# Altium project SpaceVNXBaseBoard.PrjPcb (part 2 of 6)

## Sheet ZynqPL_DDR.SchDoc: ZynqPL_DDR
size A3; Author: Carlos Barreiro; Organization: Escuela Técnica Superior de Ingeniería de Sistemas Informáticos de la Universidad Politécnica de Madrid; Address1: Campus Sur de la Universidad Politécnica de Madrid; Address2: Calle de Alan Turing, s/nº; Address3: Madrid 28031; Address4: España; DocumentNumber: 6; Revision: A; SheetNumber: 6; SheetTotal: 16
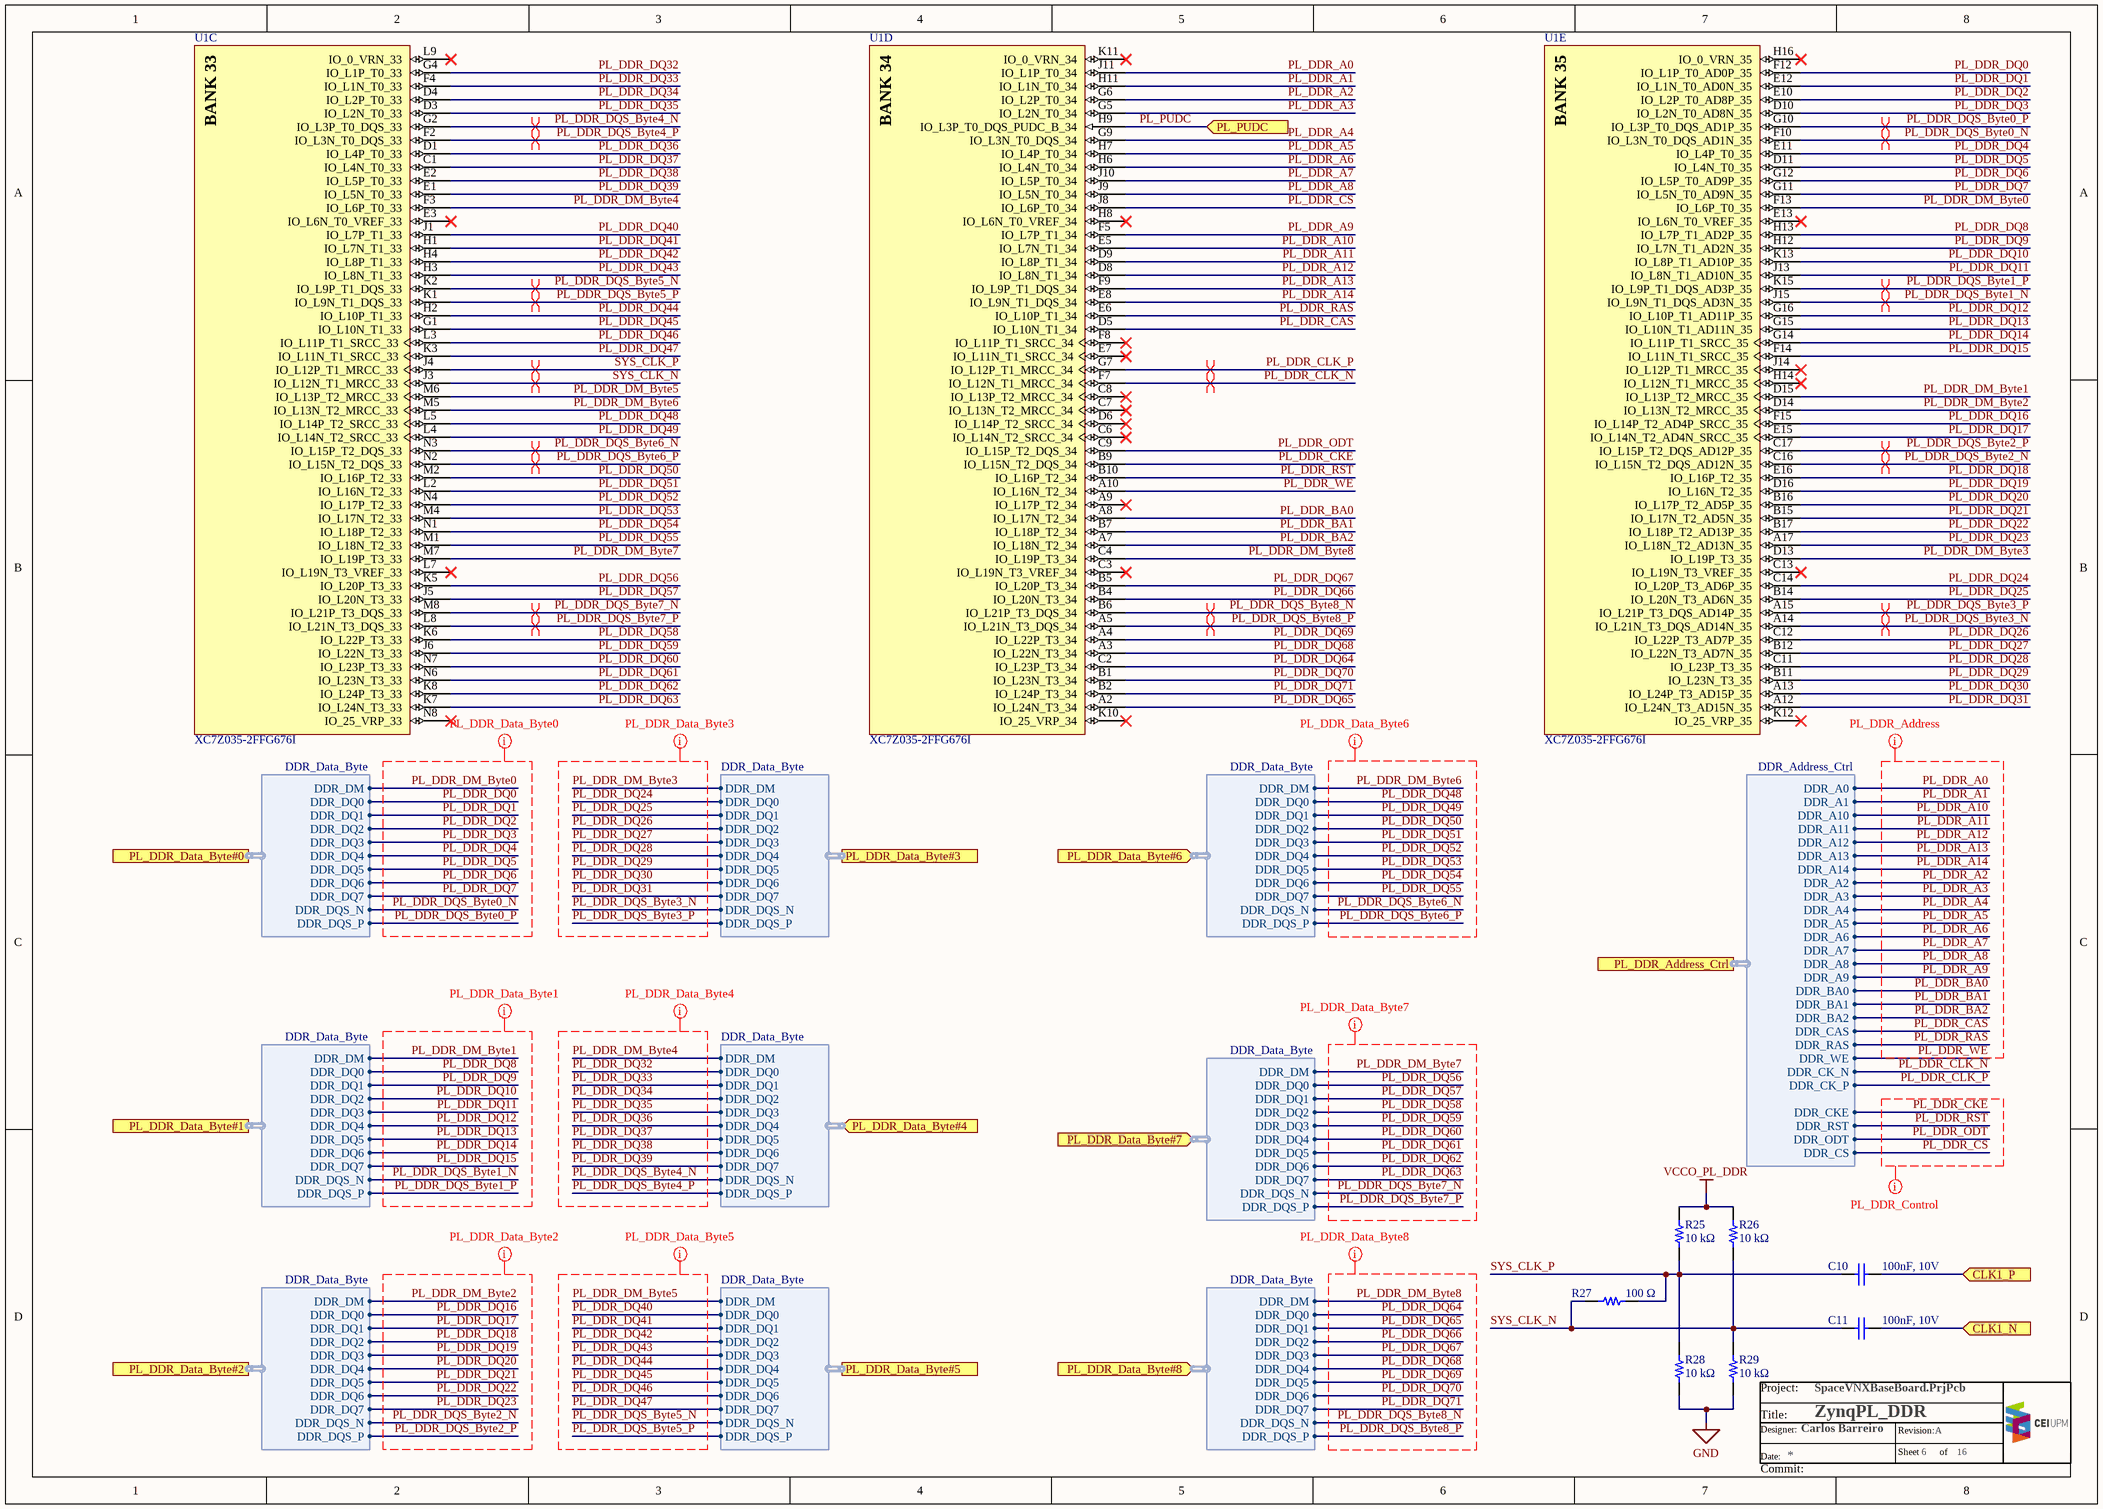
[diagram p3: ZynqPL_DDR.SchDoc]

### Parts
C10  100nF, 10V  [WURTH_WCAP-CSGP_0402]
C11  100nF, 10V  [WURTH_WCAP-CSGP_0402]
R25  10 kΩ  [PANASONIC_ERJ2G_0402]
R26  10 kΩ  [PANASONIC_ERJ2G_0402]
R27  100 Ω  [PANASONIC_ERJ2G_0402]
R28  10 kΩ  [PANASONIC_ERJ2G_0402]
R29  10 kΩ  [PANASONIC_ERJ2G_0402]
U1  XC7Z035-2FFG676I  [XILINX_FBG676]  (parts C,D,E of 13)

### Ports
CLK1_N (in), CLK1_P (in), PL_DDR_Address_Ctrl (harness DDR_Address_Ctrl), PL_DDR_Data_Byte#0 (harness DDR_Data_Byte), PL_DDR_Data_Byte#1 (harness DDR_Data_Byte), PL_DDR_Data_Byte#2 (harness DDR_Data_Byte), PL_DDR_Data_Byte#3 (harness DDR_Data_Byte), PL_DDR_Data_Byte#4 (in, harness DDR_Data_Byte), PL_DDR_Data_Byte#5 (harness DDR_Data_Byte), PL_DDR_Data_Byte#6 (in, harness DDR_Data_Byte), PL_DDR_Data_Byte#7 (in, harness DDR_Data_Byte), PL_DDR_Data_Byte#8 (in, harness DDR_Data_Byte), PL_PUDC (in)

### Harnesses
DDR_Data_Byte: DDR_DM, DDR_DQ0, DDR_DQ1, DDR_DQ2, DDR_DQ3, DDR_DQ4, DDR_DQ5, DDR_DQ6, DDR_DQ7, DDR_DQS_N, DDR_DQS_P
DDR_Address_Ctrl: DDR_A0, DDR_A1, DDR_A10, DDR_A11, DDR_A12, DDR_A13, DDR_A14, DDR_A2, DDR_A3, DDR_A4, DDR_A5, DDR_A6, DDR_A7, DDR_A8, DDR_A9, DDR_BA0, DDR_BA1, DDR_BA2, DDR_CAS, DDR_CK_N, DDR_CK_P, DDR_CKE, DDR_CS, DDR_ODT, DDR_RAS, DDR_RST, DDR_WE

### Nets
GND: R28.1 R29.1
VCCO_PL_DDR: R25.2 R26.2
OUT1_N: C11.2 ; port CLK1_N
OUT1_P: C10.2 ; port CLK1_P
PL_DDR_A0: U1.J11(IO_L1P_T0_34) ; port PL_DDR_Address_Ctrl.DDR_A0
PL_DDR_A1: U1.H11(IO_L1N_T0_34) ; port PL_DDR_Address_Ctrl.DDR_A1
PL_DDR_A2: U1.G6(IO_L2P_T0_34) ; port PL_DDR_Address_Ctrl.DDR_A2
PL_DDR_A3: U1.G5(IO_L2N_T0_34) ; port PL_DDR_Address_Ctrl.DDR_A3
PL_DDR_A4: U1.G9(IO_L3N_T0_DQS_34) ; port PL_DDR_Address_Ctrl.DDR_A4
PL_DDR_A5: U1.H7(IO_L4P_T0_34) ; port PL_DDR_Address_Ctrl.DDR_A5
PL_DDR_A6: U1.H6(IO_L4N_T0_34) ; port PL_DDR_Address_Ctrl.DDR_A6
PL_DDR_A7: U1.J10(IO_L5P_T0_34) ; port PL_DDR_Address_Ctrl.DDR_A7
PL_DDR_A8: U1.J9(IO_L5N_T0_34) ; port PL_DDR_Address_Ctrl.DDR_A8
PL_DDR_A9: U1.F5(IO_L7P_T1_34) ; port PL_DDR_Address_Ctrl.DDR_A9
PL_DDR_A10: U1.E5(IO_L7N_T1_34) ; port PL_DDR_Address_Ctrl.DDR_A10
PL_DDR_A11: U1.D9(IO_L8P_T1_34) ; port PL_DDR_Address_Ctrl.DDR_A11
PL_DDR_A12: U1.D8(IO_L8N_T1_34) ; port PL_DDR_Address_Ctrl.DDR_A12
PL_DDR_A13: U1.F9(IO_L9P_T1_DQS_34) ; port PL_DDR_Address_Ctrl.DDR_A13
PL_DDR_A14: U1.E8(IO_L9N_T1_DQS_34) ; port PL_DDR_Address_Ctrl.DDR_A14
PL_DDR_BA0: U1.A8(IO_L17N_T2_34) ; port PL_DDR_Address_Ctrl.DDR_BA0
PL_DDR_BA1: U1.B7(IO_L18P_T2_34) ; port PL_DDR_Address_Ctrl.DDR_BA1
PL_DDR_BA2: U1.A7(IO_L18N_T2_34) ; port PL_DDR_Address_Ctrl.DDR_BA2
PL_DDR_CAS: U1.D5(IO_L10N_T1_34) ; port PL_DDR_Address_Ctrl.DDR_CAS
PL_DDR_CKE: U1.B9(IO_L15N_T2_DQS_34) ; port PL_DDR_Address_Ctrl.DDR_CKE
PL_DDR_CLK_N: U1.F7(IO_L12N_T1_MRCC_34) ; port PL_DDR_Address_Ctrl.DDR_CK_N
PL_DDR_CLK_P: U1.G7(IO_L12P_T1_MRCC_34) ; port PL_DDR_Address_Ctrl.DDR_CK_P
PL_DDR_CS: U1.J8(IO_L6P_T0_34) ; port PL_DDR_Address_Ctrl.DDR_CS
PL_DDR_DM_Byte0: U1.F13(IO_L6P_T0_35) ; port PL_DDR_Data_Byte#0.DDR_DM
PL_DDR_DM_Byte1: U1.D15(IO_L13P_T2_MRCC_35) ; port PL_DDR_Data_Byte#1.DDR_DM
PL_DDR_DM_Byte2: U1.D14(IO_L13N_T2_MRCC_35) ; port PL_DDR_Data_Byte#2.DDR_DM
PL_DDR_DM_Byte3: U1.D13(IO_L19P_T3_35) ; port PL_DDR_Data_Byte#3.DDR_DM
PL_DDR_DM_Byte4: U1.F3(IO_L6P_T0_33) ; port PL_DDR_Data_Byte#4.DDR_DM
PL_DDR_DM_Byte5: U1.M6(IO_L13P_T2_MRCC_33) ; port PL_DDR_Data_Byte#5.DDR_DM
PL_DDR_DM_Byte6: U1.M5(IO_L13N_T2_MRCC_33) ; port PL_DDR_Data_Byte#6.DDR_DM
PL_DDR_DM_Byte7: U1.M7(IO_L19P_T3_33) ; port PL_DDR_Data_Byte#7.DDR_DM
PL_DDR_DM_Byte8: U1.C4(IO_L19P_T3_34) ; port PL_DDR_Data_Byte#8.DDR_DM
PL_DDR_DQ0: U1.F12(IO_L1P_T0_AD0P_35) ; port PL_DDR_Data_Byte#0.DDR_DQ0
PL_DDR_DQ1: U1.E12(IO_L1N_T0_AD0N_35) ; port PL_DDR_Data_Byte#0.DDR_DQ1
PL_DDR_DQ2: U1.E10(IO_L2P_T0_AD8P_35) ; port PL_DDR_Data_Byte#0.DDR_DQ2
PL_DDR_DQ3: U1.D10(IO_L2N_T0_AD8N_35) ; port PL_DDR_Data_Byte#0.DDR_DQ3
PL_DDR_DQ4: U1.E11(IO_L4P_T0_35) ; port PL_DDR_Data_Byte#0.DDR_DQ4
PL_DDR_DQ5: U1.D11(IO_L4N_T0_35) ; port PL_DDR_Data_Byte#0.DDR_DQ5
PL_DDR_DQ6: U1.G12(IO_L5P_T0_AD9P_35) ; port PL_DDR_Data_Byte#0.DDR_DQ6
PL_DDR_DQ7: U1.G11(IO_L5N_T0_AD9N_35) ; port PL_DDR_Data_Byte#0.DDR_DQ7
PL_DDR_DQ8: U1.H13(IO_L7P_T1_AD2P_35) ; port PL_DDR_Data_Byte#1.DDR_DQ0
PL_DDR_DQ9: U1.H12(IO_L7N_T1_AD2N_35) ; port PL_DDR_Data_Byte#1.DDR_DQ1
PL_DDR_DQ10: U1.K13(IO_L8P_T1_AD10P_35) ; port PL_DDR_Data_Byte#1.DDR_DQ2
PL_DDR_DQ11: U1.J13(IO_L8N_T1_AD10N_35) ; port PL_DDR_Data_Byte#1.DDR_DQ3
PL_DDR_DQ12: U1.G16(IO_L10P_T1_AD11P_35) ; port PL_DDR_Data_Byte#1.DDR_DQ4
PL_DDR_DQ13: U1.G15(IO_L10N_T1_AD11N_35) ; port PL_DDR_Data_Byte#1.DDR_DQ5
PL_DDR_DQ14: U1.G14(IO_L11P_T1_SRCC_35) ; port PL_DDR_Data_Byte#1.DDR_DQ6
PL_DDR_DQ15: U1.F14(IO_L11N_T1_SRCC_35) ; port PL_DDR_Data_Byte#1.DDR_DQ7
PL_DDR_DQ16: U1.F15(IO_L14P_T2_AD4P_SRCC_35) ; port PL_DDR_Data_Byte#2.DDR_DQ0
PL_DDR_DQ17: U1.E15(IO_L14N_T2_AD4N_SRCC_35) ; port PL_DDR_Data_Byte#2.DDR_DQ1
PL_DDR_DQ18: U1.E16(IO_L16P_T2_35) ; port PL_DDR_Data_Byte#2.DDR_DQ2
PL_DDR_DQ19: U1.D16(IO_L16N_T2_35) ; port PL_DDR_Data_Byte#2.DDR_DQ3
PL_DDR_DQ20: U1.B16(IO_L17P_T2_AD5P_35) ; port PL_DDR_Data_Byte#2.DDR_DQ4
PL_DDR_DQ21: U1.B15(IO_L17N_T2_AD5N_35) ; port PL_DDR_Data_Byte#2.DDR_DQ5
PL_DDR_DQ22: U1.B17(IO_L18P_T2_AD13P_35) ; port PL_DDR_Data_Byte#2.DDR_DQ6
PL_DDR_DQ23: U1.A17(IO_L18N_T2_AD13N_35) ; port PL_DDR_Data_Byte#2.DDR_DQ7
PL_DDR_DQ24: U1.C14(IO_L20P_T3_AD6P_35) ; port PL_DDR_Data_Byte#3.DDR_DQ0
PL_DDR_DQ25: U1.B14(IO_L20N_T3_AD6N_35) ; port PL_DDR_Data_Byte#3.DDR_DQ1
PL_DDR_DQ26: U1.C12(IO_L22P_T3_AD7P_35) ; port PL_DDR_Data_Byte#3.DDR_DQ2
PL_DDR_DQ27: U1.B12(IO_L22N_T3_AD7N_35) ; port PL_DDR_Data_Byte#3.DDR_DQ3
PL_DDR_DQ28: U1.C11(IO_L23P_T3_35) ; port PL_DDR_Data_Byte#3.DDR_DQ4
PL_DDR_DQ29: U1.B11(IO_L23N_T3_35) ; port PL_DDR_Data_Byte#3.DDR_DQ5
PL_DDR_DQ30: U1.A13(IO_L24P_T3_AD15P_35) ; port PL_DDR_Data_Byte#3.DDR_DQ6
PL_DDR_DQ31: U1.A12(IO_L24N_T3_AD15N_35) ; port PL_DDR_Data_Byte#3.DDR_DQ7
PL_DDR_DQ32: U1.G4(IO_L1P_T0_33) ; port PL_DDR_Data_Byte#4.DDR_DQ0
PL_DDR_DQ33: U1.F4(IO_L1N_T0_33) ; port PL_DDR_Data_Byte#4.DDR_DQ1
PL_DDR_DQ34: U1.D4(IO_L2P_T0_33) ; port PL_DDR_Data_Byte#4.DDR_DQ2
PL_DDR_DQ35: U1.D3(IO_L2N_T0_33) ; port PL_DDR_Data_Byte#4.DDR_DQ3
PL_DDR_DQ36: U1.D1(IO_L4P_T0_33) ; port PL_DDR_Data_Byte#4.DDR_DQ4
PL_DDR_DQ37: U1.C1(IO_L4N_T0_33) ; port PL_DDR_Data_Byte#4.DDR_DQ5
PL_DDR_DQ38: U1.E2(IO_L5P_T0_33) ; port PL_DDR_Data_Byte#4.DDR_DQ6
PL_DDR_DQ39: U1.E1(IO_L5N_T0_33) ; port PL_DDR_Data_Byte#4.DDR_DQ7
PL_DDR_DQ40: U1.J1(IO_L7P_T1_33) ; port PL_DDR_Data_Byte#5.DDR_DQ0
PL_DDR_DQ41: U1.H1(IO_L7N_T1_33) ; port PL_DDR_Data_Byte#5.DDR_DQ1
PL_DDR_DQ42: U1.H4(IO_L8P_T1_33) ; port PL_DDR_Data_Byte#5.DDR_DQ2
PL_DDR_DQ43: U1.H3(IO_L8N_T1_33) ; port PL_DDR_Data_Byte#5.DDR_DQ3
PL_DDR_DQ44: U1.H2(IO_L10P_T1_33) ; port PL_DDR_Data_Byte#5.DDR_DQ4
PL_DDR_DQ45: U1.G1(IO_L10N_T1_33) ; port PL_DDR_Data_Byte#5.DDR_DQ5
PL_DDR_DQ46: U1.L3(IO_L11P_T1_SRCC_33) ; port PL_DDR_Data_Byte#5.DDR_DQ6
PL_DDR_DQ47: U1.K3(IO_L11N_T1_SRCC_33) ; port PL_DDR_Data_Byte#5.DDR_DQ7
PL_DDR_DQ48: U1.L5(IO_L14P_T2_SRCC_33) ; port PL_DDR_Data_Byte#6.DDR_DQ0
PL_DDR_DQ49: U1.L4(IO_L14N_T2_SRCC_33) ; port PL_DDR_Data_Byte#6.DDR_DQ1
PL_DDR_DQ50: U1.M2(IO_L16P_T2_33) ; port PL_DDR_Data_Byte#6.DDR_DQ2
PL_DDR_DQ51: U1.L2(IO_L16N_T2_33) ; port PL_DDR_Data_Byte#6.DDR_DQ3
PL_DDR_DQ52: U1.N4(IO_L17P_T2_33) ; port PL_DDR_Data_Byte#6.DDR_DQ4
PL_DDR_DQ53: U1.M4(IO_L17N_T2_33) ; port PL_DDR_Data_Byte#6.DDR_DQ5
PL_DDR_DQ54: U1.N1(IO_L18P_T2_33) ; port PL_DDR_Data_Byte#6.DDR_DQ6
PL_DDR_DQ55: U1.M1(IO_L18N_T2_33) ; port PL_DDR_Data_Byte#6.DDR_DQ7
PL_DDR_DQ56: U1.K5(IO_L20P_T3_33) ; port PL_DDR_Data_Byte#7.DDR_DQ0
PL_DDR_DQ57: U1.J5(IO_L20N_T3_33) ; port PL_DDR_Data_Byte#7.DDR_DQ1
PL_DDR_DQ58: U1.K6(IO_L22P_T3_33) ; port PL_DDR_Data_Byte#7.DDR_DQ2
PL_DDR_DQ59: U1.J6(IO_L22N_T3_33) ; port PL_DDR_Data_Byte#7.DDR_DQ3
PL_DDR_DQ60: U1.N7(IO_L23P_T3_33) ; port PL_DDR_Data_Byte#7.DDR_DQ4
PL_DDR_DQ61: U1.N6(IO_L23N_T3_33) ; port PL_DDR_Data_Byte#7.DDR_DQ5
PL_DDR_DQ62: U1.K8(IO_L24P_T3_33) ; port PL_DDR_Data_Byte#7.DDR_DQ6
PL_DDR_DQ63: U1.K7(IO_L24N_T3_33) ; port PL_DDR_Data_Byte#7.DDR_DQ7
PL_DDR_DQ64: U1.C2(IO_L23P_T3_34) ; port PL_DDR_Data_Byte#8.DDR_DQ0
PL_DDR_DQ65: U1.A2(IO_L24N_T3_34) ; port PL_DDR_Data_Byte#8.DDR_DQ1
PL_DDR_DQ66: U1.B4(IO_L20N_T3_34) ; port PL_DDR_Data_Byte#8.DDR_DQ2
PL_DDR_DQ67: U1.B5(IO_L20P_T3_34) ; port PL_DDR_Data_Byte#8.DDR_DQ3
PL_DDR_DQ68: U1.A3(IO_L22N_T3_34) ; port PL_DDR_Data_Byte#8.DDR_DQ4
PL_DDR_DQ69: U1.A4(IO_L22P_T3_34) ; port PL_DDR_Data_Byte#8.DDR_DQ5
PL_DDR_DQ70: U1.B1(IO_L23N_T3_34) ; port PL_DDR_Data_Byte#8.DDR_DQ6
PL_DDR_DQ71: U1.B2(IO_L24P_T3_34) ; port PL_DDR_Data_Byte#8.DDR_DQ7
PL_DDR_DQS_Byte0_N: U1.F10(IO_L3N_T0_DQS_AD1N_35) ; port PL_DDR_Data_Byte#0.DDR_DQS_N
PL_DDR_DQS_Byte0_P: U1.G10(IO_L3P_T0_DQS_AD1P_35) ; port PL_DDR_Data_Byte#0.DDR_DQS_P
PL_DDR_DQS_Byte1_N: U1.J15(IO_L9N_T1_DQS_AD3N_35) ; port PL_DDR_Data_Byte#1.DDR_DQS_N
PL_DDR_DQS_Byte1_P: U1.K15(IO_L9P_T1_DQS_AD3P_35) ; port PL_DDR_Data_Byte#1.DDR_DQS_P
PL_DDR_DQS_Byte2_N: U1.C16(IO_L15N_T2_DQS_AD12N_35) ; port PL_DDR_Data_Byte#2.DDR_DQS_N
PL_DDR_DQS_Byte2_P: U1.C17(IO_L15P_T2_DQS_AD12P_35) ; port PL_DDR_Data_Byte#2.DDR_DQS_P
PL_DDR_DQS_Byte3_N: U1.A14(IO_L21N_T3_DQS_AD14N_35) ; port PL_DDR_Data_Byte#3.DDR_DQS_N
PL_DDR_DQS_Byte3_P: U1.A15(IO_L21P_T3_DQS_AD14P_35) ; port PL_DDR_Data_Byte#3.DDR_DQS_P
PL_DDR_DQS_Byte4_N: U1.G2(IO_L3P_T0_DQS_33) ; port PL_DDR_Data_Byte#4.DDR_DQS_N
PL_DDR_DQS_Byte4_P: U1.F2(IO_L3N_T0_DQS_33) ; port PL_DDR_Data_Byte#4.DDR_DQS_P
PL_DDR_DQS_Byte5_N: U1.K2(IO_L9P_T1_DQS_33) ; port PL_DDR_Data_Byte#5.DDR_DQS_N
PL_DDR_DQS_Byte5_P: U1.K1(IO_L9N_T1_DQS_33) ; port PL_DDR_Data_Byte#5.DDR_DQS_P
PL_DDR_DQS_Byte6_N: U1.N3(IO_L15P_T2_DQS_33) ; port PL_DDR_Data_Byte#6.DDR_DQS_N
PL_DDR_DQS_Byte6_P: U1.N2(IO_L15N_T2_DQS_33) ; port PL_DDR_Data_Byte#6.DDR_DQS_P
PL_DDR_DQS_Byte7_N: U1.M8(IO_L21P_T3_DQS_33) ; port PL_DDR_Data_Byte#7.DDR_DQS_N
PL_DDR_DQS_Byte7_P: U1.L8(IO_L21N_T3_DQS_33) ; port PL_DDR_Data_Byte#7.DDR_DQS_P
PL_DDR_DQS_Byte8_N: U1.B6(IO_L21P_T3_DQS_34) ; port PL_DDR_Data_Byte#8.DDR_DQS_N
PL_DDR_DQS_Byte8_P: U1.A5(IO_L21N_T3_DQS_34) ; port PL_DDR_Data_Byte#8.DDR_DQS_P
PL_DDR_ODT: U1.C9(IO_L15P_T2_DQS_34) ; port PL_DDR_Address_Ctrl.DDR_ODT
PL_DDR_RAS: U1.E6(IO_L10P_T1_34) ; port PL_DDR_Address_Ctrl.DDR_RAS
PL_DDR_RST: U1.B10(IO_L16P_T2_34) ; port PL_DDR_Address_Ctrl.DDR_RST
PL_DDR_WE: U1.A10(IO_L16N_T2_34) ; port PL_DDR_Address_Ctrl.DDR_WE
PL_PUDC: U1.H9(IO_L3P_T0_DQS_PUDC_B_34) ; port PL_PUDC
SYS_CLK_N: C11.1 R26.1 R27.1 R29.2 U1.J3(IO_L12N_T1_MRCC_33)
SYS_CLK_P: C10.1 R25.1 R27.2 R28.2 U1.J4(IO_L12P_T1_MRCC_33)

Not connected (* = marked no-connect by the designer): U1 A9(IO_L17P_T2_34)* C3(IO_L19N_T3_VREF_34)* C6(IO_L14N_T2_SRCC_34)* C7(IO_L13N_T2_MRCC_34)* C8(IO_L13P_T2_MRCC_34)* C13(IO_L19N_T3_VREF_35)* D6(IO_L14P_T2_SRCC_34)* E3(IO_L6N_T0_VREF_33)* E7(IO_L11N_T1_SRCC_34)* E13(IO_L6N_T0_VREF_35)* F8(IO_L11P_T1_SRCC_34)* H8(IO_L6N_T0_VREF_34)* H14(IO_L12N_T1_MRCC_35)* H16(IO_0_VRN_35)* J14(IO_L12P_T1_MRCC_35)* K10(IO_25_VRP_34)* K11(IO_0_VRN_34)* K12(IO_25_VRP_35)* L7(IO_L19N_T3_VREF_33)* L9(IO_0_VRN_33)* N8(IO_25_VRP_33)*

### Layout directives
differential pair: PL_DDR_CLK_N, PL_DDR_CLK_P, PL_DDR_DQS_Byte0_N, PL_DDR_DQS_Byte0_P, PL_DDR_DQS_Byte1_N, PL_DDR_DQS_Byte1_P, PL_DDR_DQS_Byte2_N, PL_DDR_DQS_Byte2_P, PL_DDR_DQS_Byte3_N, PL_DDR_DQS_Byte3_P, PL_DDR_DQS_Byte4_N, PL_DDR_DQS_Byte4_P, PL_DDR_DQS_Byte5_N, PL_DDR_DQS_Byte5_P, PL_DDR_DQS_Byte6_N, PL_DDR_DQS_Byte6_P, PL_DDR_DQS_Byte7_N, PL_DDR_DQS_Byte7_P, PL_DDR_DQS_Byte8_N, PL_DDR_DQS_Byte8_P, SYS_CLK_N, SYS_CLK_P
net class PL_DDR_Address: PL_DDR_A0, PL_DDR_A1, PL_DDR_A2, PL_DDR_A3, PL_DDR_A4, PL_DDR_A5, PL_DDR_A6, PL_DDR_A7, PL_DDR_A8, PL_DDR_A9, PL_DDR_A10, PL_DDR_A11, PL_DDR_A12, PL_DDR_A13, PL_DDR_A14, PL_DDR_BA0, PL_DDR_BA1, PL_DDR_BA2, PL_DDR_CAS, PL_DDR_RAS, PL_DDR_WE
net class PL_DDR_Data_Byte6: PL_DDR_DM_Byte6, PL_DDR_DQ48, PL_DDR_DQ49, PL_DDR_DQ50, PL_DDR_DQ51, PL_DDR_DQ52, PL_DDR_DQ53, PL_DDR_DQ54, PL_DDR_DQ55, PL_DDR_DQS_Byte6_N, PL_DDR_DQS_Byte6_P
net class PL_DDR_Data_Byte7: PL_DDR_DM_Byte7, PL_DDR_DQ56, PL_DDR_DQ57, PL_DDR_DQ58, PL_DDR_DQ59, PL_DDR_DQ60, PL_DDR_DQ61, PL_DDR_DQ62, PL_DDR_DQ63, PL_DDR_DQS_Byte7_N, PL_DDR_DQS_Byte7_P
net class PL_DDR_Data_Byte8: PL_DDR_DM_Byte8, PL_DDR_DQ64, PL_DDR_DQ65, PL_DDR_DQ66, PL_DDR_DQ67, PL_DDR_DQ68, PL_DDR_DQ69, PL_DDR_DQ70, PL_DDR_DQ71, PL_DDR_DQS_Byte8_N, PL_DDR_DQS_Byte8_P
net class PL_DDR_Data_Byte3: PL_DDR_DM_Byte3, PL_DDR_DQ24, PL_DDR_DQ25, PL_DDR_DQ26, PL_DDR_DQ27, PL_DDR_DQ28, PL_DDR_DQ29, PL_DDR_DQ30, PL_DDR_DQ31, PL_DDR_DQS_Byte3_N, PL_DDR_DQS_Byte3_P
net class PL_DDR_Data_Byte4: PL_DDR_DM_Byte4, PL_DDR_DQ32, PL_DDR_DQ33, PL_DDR_DQ34, PL_DDR_DQ35, PL_DDR_DQ36, PL_DDR_DQ37, PL_DDR_DQ38, PL_DDR_DQ39, PL_DDR_DQS_Byte4_N, PL_DDR_DQS_Byte4_P
net class PL_DDR_Data_Byte5: PL_DDR_DM_Byte5, PL_DDR_DQ40, PL_DDR_DQ41, PL_DDR_DQ42, PL_DDR_DQ43, PL_DDR_DQ44, PL_DDR_DQ45, PL_DDR_DQ46, PL_DDR_DQ47, PL_DDR_DQS_Byte5_N, PL_DDR_DQS_Byte5_P
net class PL_DDR_Data_Byte2: PL_DDR_DM_Byte2, PL_DDR_DQ16, PL_DDR_DQ17, PL_DDR_DQ18, PL_DDR_DQ19, PL_DDR_DQ20, PL_DDR_DQ21, PL_DDR_DQ22, PL_DDR_DQ23, PL_DDR_DQS_Byte2_N, PL_DDR_DQS_Byte2_P
net class PL_DDR_Data_Byte1: PL_DDR_DM_Byte1, PL_DDR_DQ8, PL_DDR_DQ9, PL_DDR_DQ10, PL_DDR_DQ11, PL_DDR_DQ12, PL_DDR_DQ13, PL_DDR_DQ14, PL_DDR_DQ15, PL_DDR_DQS_Byte1_N, PL_DDR_DQS_Byte1_P
net class PL_DDR_Data_Byte0: PL_DDR_DM_Byte0, PL_DDR_DQ0, PL_DDR_DQ1, PL_DDR_DQ2, PL_DDR_DQ3, PL_DDR_DQ4, PL_DDR_DQ5, PL_DDR_DQ6, PL_DDR_DQ7, PL_DDR_DQS_Byte0_N, PL_DDR_DQS_Byte0_P
net class PL_DDR_Control: PL_DDR_CKE, PL_DDR_CS, PL_DDR_ODT, PL_DDR_RST

### Notes on the sheet
- Project:
- Title:
- Date:
- Designer:
- Sheet
- Revision:
- of
- Commit:
- (in symbol XC7Z035-2FFG676I, part C) BANK 33
- (in symbol XC7Z035-2FFG676I, part D) BANK 34
- (in symbol XC7Z035-2FFG676I, part E) BANK 35

### Library data of the parts
C10 C11 = 885012205018: WCAP-CSGP Multilayer Ceramic Chip Capacitor, General Purpose, size 0402, X7R, 100nF, 10V; Manufacturer: Wurth Elektronik; Rated Voltage: 10VDC; Isolation Resistance  min.: 5GOhm; Capacitance Tolerance: +/-10%; Dissipation Factor max.: 5%; Technical Reference: X7R0402104K010DFCT10000; ComponentLink1Description: Manufacturer; ComponentLink1URL: http://www.we-online.de; ComponentLink2Description: Datasheet; ComponentLink2URL: https://www.we-online.com/catalog/datasheet/885012205018.pdf; Operating Temperature: -55 to +125degC; Packaging: Tape and Reel; Manufacturer Part Number: 885012205018; Published Date: April 2021; Ceramic Type: X7R; Height: 0.5mm; Mounting Technology: SMT; Size: 0402; Capacitance: 100nF; Q-Factor min.: -
R25 R26 R28 R29 = ERJ2RKF1002X: General Purpose Thick Film Chip Resistors; Manufacturer: Panasonic; Power (0402): 0.1 W; Limiting Voltage (0402): 50; Maximum Voltage (0402): 100; Resistance Range (Ω): 1Ω to 100MΩ; AEC 200: Grade 0; Size (0402): 2GE; ComponentLink1Description: Catalog; ComponentLink1URL: https://industrial.panasonic.com/ww/products/pt/general-purpose-chip-resistors/models?op=search&model_status_current=1&page=0#model-list-search-results; Series: ERJ; Temperature Range (ºC): -55 to +155; Supplier 1: Digi-Key; Supplier 2: Mouser; Supplier Part Number 1: P10.0KLCT-ND; Supplier Part Number 2: 667-ERJ-2RKF1002X
R27 = ERJ2GEJ101X: General Purpose Thick Film Chip Resistors; Manufacturer: Panasonic; Power (0402): 0.1 W; Limiting Voltage (0402): 50; Maximum Voltage (0402): 100; Resistance Range (Ω): 1Ω to 100MΩ; AEC 200: Grade 0; Size (0402): 2GE; ComponentLink1Description: Catalog; ComponentLink1URL: https://industrial.panasonic.com/ww/products/pt/general-purpose-chip-resistors/models?op=search&model_status_current=1&page=0#model-list-search-results; Series: ERJ; Temperature Range (ºC): -55 to +155; Supplier 1: Digi-Key; Supplier 2: Mouser; Supplier Part Number 2: 667-ERJ-2GEJ101X; Supplier Part Number 1: P100JTR-ND
U1 = XC7Z035-2FFG676I: 667 MHz Zynq™-7000 AP SoC, 130 PS I/O, 254 FPGA I/O, 676-Ball BGA, Speed Grade 1, Commercial Grade, Pb-Free; PartNumber: XC7Z035-2FBG676I; LUTs: 171,900; Extensible Block RAM (# 36Kb Blocks): 17.6Mb (500); Speed Grade: -2; Flip Flops: 343,800; ComponentLink5Description: Packaging and Pinout; ComponentLink4Description: Package File; ComponentLink5URL: http://www.xilinx.com/support/documentation/user_guides/ug865-Zynq-7000-Pkg-Pinout.pdf; Generic Part Number: XC7Z035; ComponentLink1Description: Datasheet; ComponentLink2Description: Package Specification; ComponentLink3URL: http://www.xilinx.com/support/documentation/data_sheets/ds191-XC7Z030-XC7Z045-data-sheet.pdf; ComponentLink1URL: http://www.xilinx.com/support/documentation/data_sheets/ds190-Zynq-7000-Overview.pdf; ComponentLink6Description: PCB and Layout Guide; Package: FBG676; ComponentLink3Description: DC and AC Switching Characteristics; ComponentLink6URL: http://www.xilinx.com/support/documentation/user_guides/ug483_7Series_PCB.pdf; RoHS: Pb-Free; ComponentLink4URL: http://www.xilinx.com/support/packagefiles/z7packages/xc7z030fbg676pkg.txt; ComponentLink2URL: http://www.xilinx.com/support/documentation/user_guides/ug475_7Series_Pkg_Pinout.pdf; PackageDescription: Flip-Chip Lidless BGA, Body 27 x 27 mm, 1.0 mm Pitch; Supplier 1: Digi-Key; Supplier 2: Mouser; Supplier Part Number 1: XC7Z035-2FFG676I-ND; Supplier Part Number 2: 217-XC7Z035-2FFG676I

## Sheet ZynqPL_GTXE2.SchDoc: ZynqPL_GTXE2
size A4; Author: Carlos Barreiro; Organization: Escuela Técnica Superior de Ingeniería de Sistemas Informáticos de la Universidad Politécnica de Madrid; Address1: Campus Sur de la Universidad Politécnica de Madrid; Address2: Calle de Alan Turing, s/nº; Address3: Madrid 28031; Address4: España; DocumentNumber: 7; Revision: A; SheetNumber: 7; SheetTotal: 16
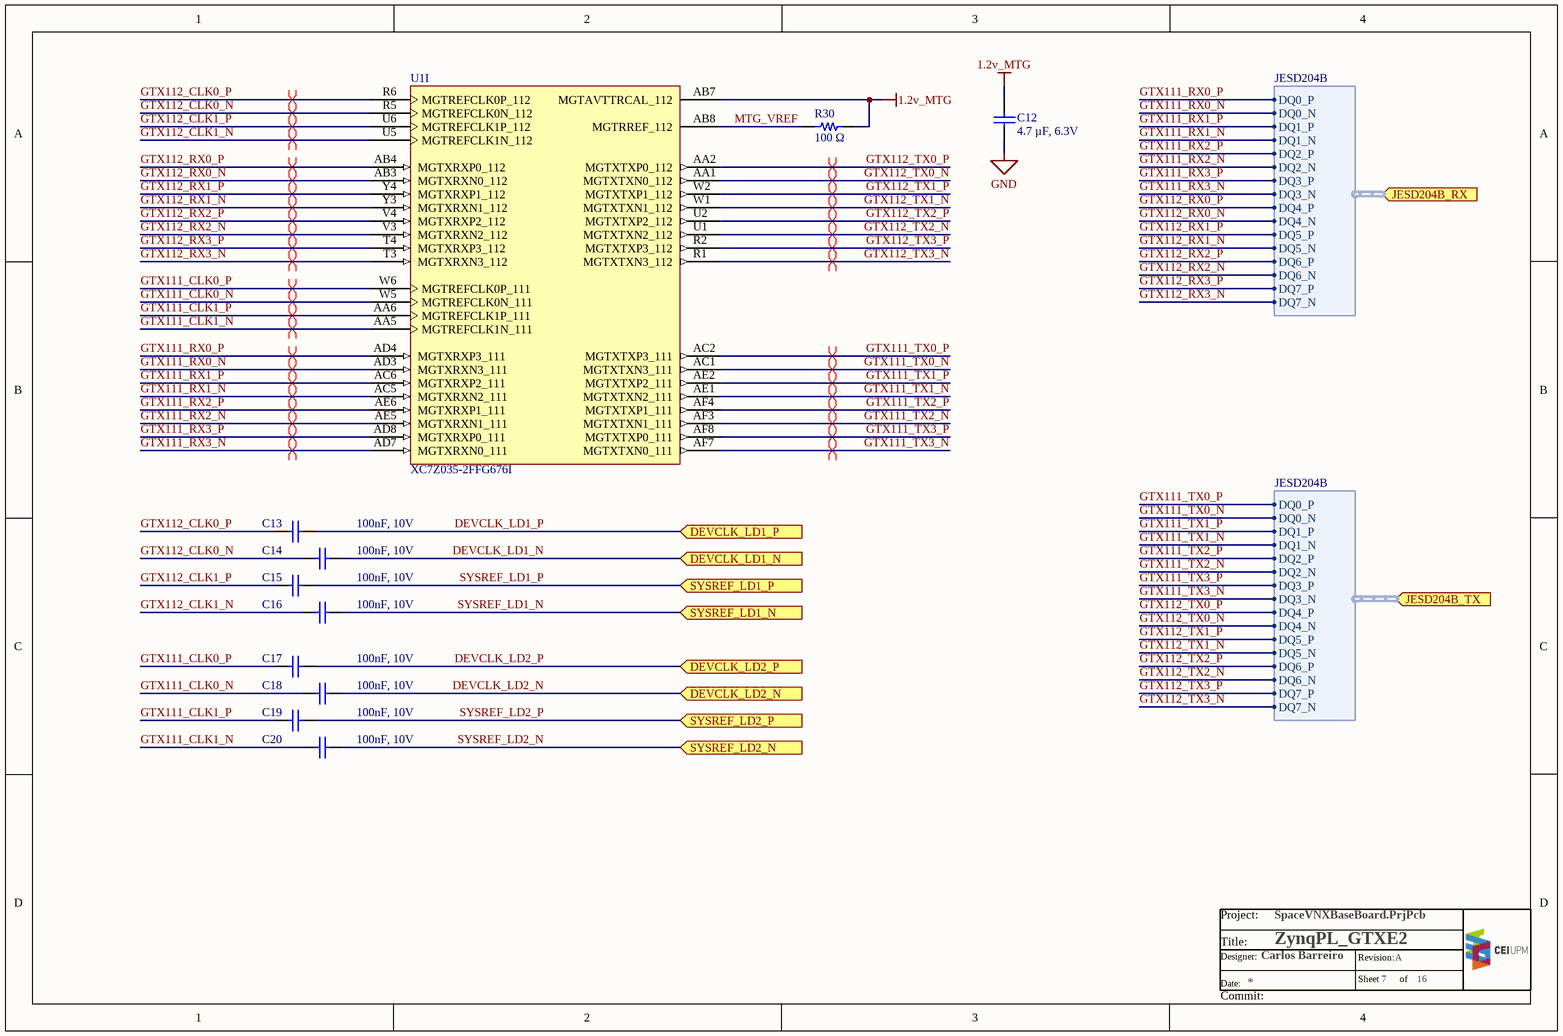
[diagram p4: ZynqPL_GTXE2.SchDoc]

### Parts
C12  4.7 µF, 6.3V  [WURTH_WCAP-CSGP_0402]
C13  100nF, 10V  [WURTH_WCAP-CSGP_0402]
C14  100nF, 10V  [WURTH_WCAP-CSGP_0402]
C15  100nF, 10V  [WURTH_WCAP-CSGP_0402]
C16  100nF, 10V  [WURTH_WCAP-CSGP_0402]
C17  100nF, 10V  [WURTH_WCAP-CSGP_0402]
C18  100nF, 10V  [WURTH_WCAP-CSGP_0402]
C19  100nF, 10V  [WURTH_WCAP-CSGP_0402]
C20  100nF, 10V  [WURTH_WCAP-CSGP_0402]
R30  100 Ω  [PANASONIC_ERJ2G_0402]
U1  XC7Z035-2FFG676I  [XILINX_FBG676]  (part I of 13)

### Ports
DEVCLK_LD1_N (in), DEVCLK_LD1_P (in), DEVCLK_LD2_N (in), DEVCLK_LD2_P (in), JESD204B_RX (in, harness JESD204B), JESD204B_TX (in, harness JESD204B), SYSREF_LD1_N (in), SYSREF_LD1_P (in), SYSREF_LD2_N (in), SYSREF_LD2_P (in)

### Harnesses
JESD204B: DQ0_P, DQ0_N, DQ1_P, DQ1_N, DQ2_P, DQ2_N, DQ3_P, DQ3_N, DQ4_P, DQ4_N, DQ5_P, DQ5_N, DQ6_P, DQ6_N, DQ7_P, DQ7_N

### Nets
1.2v_MTG: C12.2 R30.2 U1.AB7(MGTAVTTRCAL_112)
GND: C12.1
DEVCLK_LD1_N: C14.2 ; port DEVCLK_LD1_N
DEVCLK_LD1_P: C13.2 ; port DEVCLK_LD1_P
DEVCLK_LD2_N: C18.2 ; port DEVCLK_LD2_N
DEVCLK_LD2_P: C17.2 ; port DEVCLK_LD2_P
GTX111_CLK0_N: C18.1 U1.W5(MGTREFCLK0N_111)
GTX111_CLK0_P: C17.1 U1.W6(MGTREFCLK0P_111)
GTX111_CLK1_N: C20.1 U1.AA5(MGTREFCLK1N_111)
GTX111_CLK1_P: C19.1 U1.AA6(MGTREFCLK1P_111)
GTX111_RX0_N: U1.AD3(MGTXRXN3_111) ; port JESD204B_RX.DQ0_N
GTX111_RX0_P: U1.AD4(MGTXRXP3_111) ; port JESD204B_RX.DQ0_P
GTX111_RX1_N: U1.AC5(MGTXRXN2_111) ; port JESD204B_RX.DQ1_N
GTX111_RX1_P: U1.AC6(MGTXRXP2_111) ; port JESD204B_RX.DQ1_P
GTX111_RX2_N: U1.AE5(MGTXRXN1_111) ; port JESD204B_RX.DQ2_N
GTX111_RX2_P: U1.AE6(MGTXRXP1_111) ; port JESD204B_RX.DQ2_P
GTX111_RX3_N: U1.AD7(MGTXRXN0_111) ; port JESD204B_RX.DQ3_N
GTX111_RX3_P: U1.AD8(MGTXRXP0_111) ; port JESD204B_RX.DQ3_P
GTX111_TX0_N: U1.AC1(MGTXTXN3_111) ; port JESD204B_TX.DQ0_N
GTX111_TX0_P: U1.AC2(MGTXTXP3_111) ; port JESD204B_TX.DQ0_P
GTX111_TX1_N: U1.AE1(MGTXTXN2_111) ; port JESD204B_TX.DQ1_N
GTX111_TX1_P: U1.AE2(MGTXTXP2_111) ; port JESD204B_TX.DQ1_P
GTX111_TX2_N: U1.AF3(MGTXTXN1_111) ; port JESD204B_TX.DQ2_N
GTX111_TX2_P: U1.AF4(MGTXTXP1_111) ; port JESD204B_TX.DQ2_P
GTX111_TX3_N: U1.AF7(MGTXTXN0_111) ; port JESD204B_TX.DQ3_N
GTX111_TX3_P: U1.AF8(MGTXTXP0_111) ; port JESD204B_TX.DQ3_P
GTX112_CLK0_N: C14.1 U1.R5(MGTREFCLK0N_112)
GTX112_CLK0_P: C13.1 U1.R6(MGTREFCLK0P_112)
GTX112_CLK1_N: C16.1 U1.U5(MGTREFCLK1N_112)
GTX112_CLK1_P: C15.1 U1.U6(MGTREFCLK1P_112)
GTX112_RX0_N: U1.AB3(MGTXRXN0_112) ; port JESD204B_RX.DQ4_N
GTX112_RX0_P: U1.AB4(MGTXRXP0_112) ; port JESD204B_RX.DQ4_P
GTX112_RX1_N: U1.Y3(MGTXRXN1_112) ; port JESD204B_RX.DQ5_N
GTX112_RX1_P: U1.Y4(MGTXRXP1_112) ; port JESD204B_RX.DQ5_P
GTX112_RX2_N: U1.V3(MGTXRXN2_112) ; port JESD204B_RX.DQ6_N
GTX112_RX2_P: U1.V4(MGTXRXP2_112) ; port JESD204B_RX.DQ6_P
GTX112_RX3_N: U1.T3(MGTXRXN3_112) ; port JESD204B_RX.DQ7_N
GTX112_RX3_P: U1.T4(MGTXRXP3_112) ; port JESD204B_RX.DQ7_P
GTX112_TX0_N: U1.AA1(MGTXTXN0_112) ; port JESD204B_TX.DQ4_N
GTX112_TX0_P: U1.AA2(MGTXTXP0_112) ; port JESD204B_TX.DQ4_P
GTX112_TX1_N: U1.W1(MGTXTXN1_112) ; port JESD204B_TX.DQ5_N
GTX112_TX1_P: U1.W2(MGTXTXP1_112) ; port JESD204B_TX.DQ5_P
GTX112_TX2_N: U1.U1(MGTXTXN2_112) ; port JESD204B_TX.DQ6_N
GTX112_TX2_P: U1.U2(MGTXTXP2_112) ; port JESD204B_TX.DQ6_P
GTX112_TX3_N: U1.R1(MGTXTXN3_112) ; port JESD204B_TX.DQ7_N
GTX112_TX3_P: U1.R2(MGTXTXP3_112) ; port JESD204B_TX.DQ7_P
MTG_VREF: R30.1 U1.AB8(MGTRREF_112)
SYSREF_LD1_N: C16.2 ; port SYSREF_LD1_N
SYSREF_LD1_P: C15.2 ; port SYSREF_LD1_P
SYSREF_LD2_N: C20.2 ; port SYSREF_LD2_N
SYSREF_LD2_P: C19.2 ; port SYSREF_LD2_P

### Layout directives
differential pair: GTX111_CLK0_N, GTX111_CLK0_P, GTX111_CLK1_N, GTX111_CLK1_P, GTX111_RX0_N, GTX111_RX0_P, GTX111_RX1_N, GTX111_RX1_P, GTX111_RX2_N, GTX111_RX2_P, GTX111_RX3_N, GTX111_RX3_P, GTX111_TX0_N, GTX111_TX0_P, GTX111_TX1_N, GTX111_TX1_P, GTX111_TX2_N, GTX111_TX2_P, GTX111_TX3_N, GTX111_TX3_P, GTX112_CLK0_N, GTX112_CLK0_P, GTX112_CLK1_N, GTX112_CLK1_P, GTX112_RX0_N, GTX112_RX0_P, GTX112_RX1_N, GTX112_RX1_P, GTX112_RX2_N, GTX112_RX2_P, GTX112_RX3_N, GTX112_RX3_P, GTX112_TX0_N, GTX112_TX0_P, GTX112_TX1_N, GTX112_TX1_P, GTX112_TX2_N, GTX112_TX2_P, GTX112_TX3_N, GTX112_TX3_P

### Notes on the sheet
- Project:
- Title:
- Date:
- Designer:
- Sheet
- Revision:
- of
- Commit:

### Library data of the parts
C12 = GRM155C80J475MEAAD: Multilayer Ceramic Capacitors MLCC, size 0402, X5R, 4.7 µF, 6.3V; Manufacturer: Murata; Rated Voltage: 6.3VDC; Ceramic Type: X6S; Capacitance Tolerance: +/-20%; Dissipation Factor max.: 10%; Capacitance: 4.7 µF; Operating Temperature: -55 to +105degC; Packaging: Tape and Reel; Manufacturer Part Number: GRM155C80J475MEAAD; Height: 0.5mm; Mounting Technology: SMT; Size: 0402; Supplier 1: Digi-Key; Supplier 2: Mouser; Supplier Part Number 1: 490-14458-1-ND; Supplier Part Number 2: 81-GRM155C80J475MEAD
C13-C20 = 885012205018: as C10 on sheet ZynqPL_DDR; ComponentLink1Description: Manufacturer; ComponentLink1URL: http://www.we-online.de; ComponentLink2Description: Datasheet; ComponentLink2URL: https://www.we-online.com/catalog/datasheet/885012205018.pdf; Operating Temperature: -55 to +125degC; Packaging: Tape and Reel; Manufacturer Part Number: 885012205018; Published Date: April 2021; Ceramic Type: X7R; Height: 0.5mm; Mounting Technology: SMT; Size: 0402; Capacitance: 100nF; Q-Factor min.: -
R30 = ERJ2GEJ101X: as R27 on sheet ZynqPL_DDR; Size (0402): 2GE; ComponentLink1Description: Catalog; ComponentLink1URL: https://industrial.panasonic.com/ww/products/pt/general-purpose-chip-resistors/models?op=search&model_status_current=1&page=0#model-list-search-results; Series: ERJ; Temperature Range (ºC): -55 to +155; Supplier 1: Digi-Key; Supplier 2: Mouser; Supplier Part Number 2: 667-ERJ-2GEJ101X; Supplier Part Number 1: P100JTR-ND
U1 = XC7Z035-2FFG676I: as U1 on sheet ZynqPL_DDR; ComponentLink5Description: Packaging and Pinout; ComponentLink4Description: Package File; ComponentLink5URL: http://www.xilinx.com/support/documentation/user_guides/ug865-Zynq-7000-Pkg-Pinout.pdf; Generic Part Number: XC7Z035; ComponentLink1Description: Datasheet; ComponentLink2Description: Package Specification; ComponentLink3URL: http://www.xilinx.com/support/documentation/data_sheets/ds191-XC7Z030-XC7Z045-data-sheet.pdf; ComponentLink1URL: http://www.xilinx.com/support/documentation/data_sheets/ds190-Zynq-7000-Overview.pdf; ComponentLink6Description: PCB and Layout Guide; Package: FBG676; ComponentLink3Description: DC and AC Switching Characteristics; ComponentLink6URL: http://www.xilinx.com/support/documentation/user_guides/ug483_7Series_PCB.pdf; RoHS: Pb-Free; ComponentLink4URL: http://www.xilinx.com/support/packagefiles/z7packages/xc7z030fbg676pkg.txt; ComponentLink2URL: http://www.xilinx.com/support/documentation/user_guides/ug475_7Series_Pkg_Pinout.pdf; PackageDescription: Flip-Chip Lidless BGA, Body 27 x 27 mm, 1.0 mm Pitch; Supplier 1: Digi-Key; Supplier 2: Mouser; Supplier Part Number 1: XC7Z035-2FFG676I-ND; Supplier Part Number 2: 217-XC7Z035-2FFG676I

## Sheet PL_DDR.SchDoc: PL_DDR
size A4 portrait; Author: Carlos Barreiro; Organization: Escuela Técnica Superior de Ingeniería de Sistemas Informáticos de la Universidad Politécnica de Madrid; Address1: Campus Sur de la Universidad Politécnica de Madrid; Address2: Calle de Alan Turing, s/nº; Address3: Madrid 28031; Address4: España; DocumentNumber: 4; Revision: A; SheetNumber: 4; SheetTotal: 16
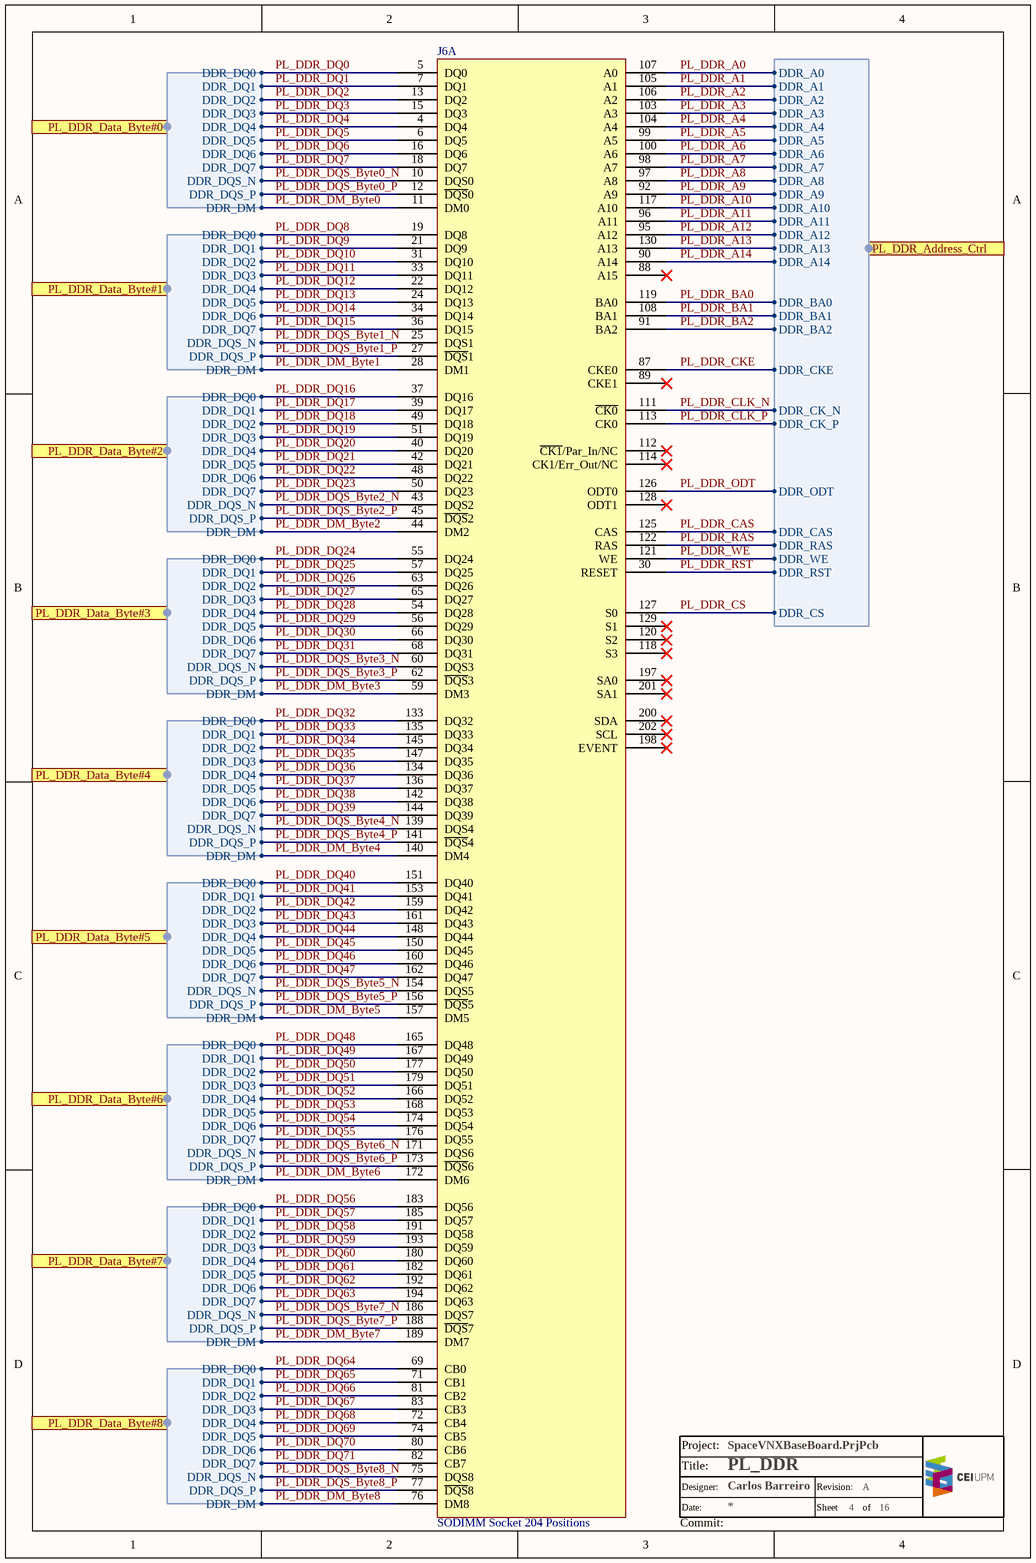
[diagram p5: PL_DDR.SchDoc]

### Parts
J6  SODIMM Socket 204 Positions  [TE_DDR3_SODIMM_RA_Socket]  (part A of 2)

### Ports
PL_DDR_Address_Ctrl (harness DDR_Address_Ctrl), PL_DDR_Data_Byte#0 (harness DDR_Data_Byte), PL_DDR_Data_Byte#1 (harness DDR_Data_Byte), PL_DDR_Data_Byte#2 (harness DDR_Data_Byte), PL_DDR_Data_Byte#3 (harness DDR_Data_Byte), PL_DDR_Data_Byte#4 (in, harness DDR_Data_Byte), PL_DDR_Data_Byte#5 (harness DDR_Data_Byte), PL_DDR_Data_Byte#6 (in, harness DDR_Data_Byte), PL_DDR_Data_Byte#7 (in, harness DDR_Data_Byte), PL_DDR_Data_Byte#8 (in, harness DDR_Data_Byte)

### Harnesses
DDR_Data_Byte: DDR_DM, DDR_DQ0, DDR_DQ1, DDR_DQ2, DDR_DQ3, DDR_DQ4, DDR_DQ5, DDR_DQ6, DDR_DQ7, DDR_DQS_N, DDR_DQS_P
DDR_Address_Ctrl: DDR_A0, DDR_A1, DDR_A10, DDR_A11, DDR_A12, DDR_A13, DDR_A14, DDR_A2, DDR_A3, DDR_A4, DDR_A5, DDR_A6, DDR_A7, DDR_A8, DDR_A9, DDR_BA0, DDR_BA1, DDR_BA2, DDR_CAS, DDR_CK_N, DDR_CK_P, DDR_CKE, DDR_CS, DDR_ODT, DDR_RAS, DDR_RST, DDR_WE

### Nets
PL_DDR_A0: J6.107(A0) ; port PL_DDR_Address_Ctrl.DDR_A0
PL_DDR_A1: J6.105(A1) ; port PL_DDR_Address_Ctrl.DDR_A1
PL_DDR_A2: J6.106(A2) ; port PL_DDR_Address_Ctrl.DDR_A2
PL_DDR_A3: J6.103(A3) ; port PL_DDR_Address_Ctrl.DDR_A3
PL_DDR_A4: J6.104(A4) ; port PL_DDR_Address_Ctrl.DDR_A4
PL_DDR_A5: J6.99(A5) ; port PL_DDR_Address_Ctrl.DDR_A5
PL_DDR_A6: J6.100(A6) ; port PL_DDR_Address_Ctrl.DDR_A6
PL_DDR_A7: J6.98(A7) ; port PL_DDR_Address_Ctrl.DDR_A7
PL_DDR_A8: J6.97(A8) ; port PL_DDR_Address_Ctrl.DDR_A8
PL_DDR_A9: J6.92(A9) ; port PL_DDR_Address_Ctrl.DDR_A9
PL_DDR_A10: J6.117(A10) ; port PL_DDR_Address_Ctrl.DDR_A10
PL_DDR_A11: J6.96(A11) ; port PL_DDR_Address_Ctrl.DDR_A11
PL_DDR_A12: J6.95(A12) ; port PL_DDR_Address_Ctrl.DDR_A12
PL_DDR_A13: J6.130(A13) ; port PL_DDR_Address_Ctrl.DDR_A13
PL_DDR_A14: J6.90(A14) ; port PL_DDR_Address_Ctrl.DDR_A14
PL_DDR_BA0: J6.119(BA0) ; port PL_DDR_Address_Ctrl.DDR_BA0
PL_DDR_BA1: J6.108(BA1) ; port PL_DDR_Address_Ctrl.DDR_BA1
PL_DDR_BA2: J6.91(BA2) ; port PL_DDR_Address_Ctrl.DDR_BA2
PL_DDR_CAS: J6.125(CAS) ; port PL_DDR_Address_Ctrl.DDR_CAS
PL_DDR_CKE: J6.87(CKE0) ; port PL_DDR_Address_Ctrl.DDR_CKE
PL_DDR_CLK_N: J6.111(~{CK0}) ; port PL_DDR_Address_Ctrl.DDR_CK_N
PL_DDR_CLK_P: J6.113(CK0) ; port PL_DDR_Address_Ctrl.DDR_CK_P
PL_DDR_CS: J6.127(S0) ; port PL_DDR_Address_Ctrl.DDR_CS
PL_DDR_DM_Byte0: J6.11(DM0) ; port PL_DDR_Data_Byte#0.DDR_DM
PL_DDR_DM_Byte1: J6.28(DM1) ; port PL_DDR_Data_Byte#1.DDR_DM
PL_DDR_DM_Byte2: J6.44(DM2) ; port PL_DDR_Data_Byte#2.DDR_DM
PL_DDR_DM_Byte3: J6.59(DM3) ; port PL_DDR_Data_Byte#3.DDR_DM
PL_DDR_DM_Byte4: J6.140(DM4) ; port PL_DDR_Data_Byte#4.DDR_DM
PL_DDR_DM_Byte5: J6.157(DM5) ; port PL_DDR_Data_Byte#5.DDR_DM
PL_DDR_DM_Byte6: J6.172(DM6) ; port PL_DDR_Data_Byte#6.DDR_DM
PL_DDR_DM_Byte7: J6.189(DM7) ; port PL_DDR_Data_Byte#7.DDR_DM
PL_DDR_DM_Byte8: J6.76(DM8) ; port PL_DDR_Data_Byte#8.DDR_DM
PL_DDR_DQ0: J6.5(DQ0) ; port PL_DDR_Data_Byte#0.DDR_DQ0
PL_DDR_DQ1: J6.7(DQ1) ; port PL_DDR_Data_Byte#0.DDR_DQ1
PL_DDR_DQ2: J6.13(DQ2) ; port PL_DDR_Data_Byte#0.DDR_DQ2
PL_DDR_DQ3: J6.15(DQ3) ; port PL_DDR_Data_Byte#0.DDR_DQ3
PL_DDR_DQ4: J6.4(DQ4) ; port PL_DDR_Data_Byte#0.DDR_DQ4
PL_DDR_DQ5: J6.6(DQ5) ; port PL_DDR_Data_Byte#0.DDR_DQ5
PL_DDR_DQ6: J6.16(DQ6) ; port PL_DDR_Data_Byte#0.DDR_DQ6
PL_DDR_DQ7: J6.18(DQ7) ; port PL_DDR_Data_Byte#0.DDR_DQ7
PL_DDR_DQ8: J6.19(DQ8) ; port PL_DDR_Data_Byte#1.DDR_DQ0
PL_DDR_DQ9: J6.21(DQ9) ; port PL_DDR_Data_Byte#1.DDR_DQ1
PL_DDR_DQ10: J6.31(DQ10) ; port PL_DDR_Data_Byte#1.DDR_DQ2
PL_DDR_DQ11: J6.33(DQ11) ; port PL_DDR_Data_Byte#1.DDR_DQ3
PL_DDR_DQ12: J6.22(DQ12) ; port PL_DDR_Data_Byte#1.DDR_DQ4
PL_DDR_DQ13: J6.24(DQ13) ; port PL_DDR_Data_Byte#1.DDR_DQ5
PL_DDR_DQ14: J6.34(DQ14) ; port PL_DDR_Data_Byte#1.DDR_DQ6
PL_DDR_DQ15: J6.36(DQ15) ; port PL_DDR_Data_Byte#1.DDR_DQ7
PL_DDR_DQ16: J6.37(DQ16) ; port PL_DDR_Data_Byte#2.DDR_DQ0
PL_DDR_DQ17: J6.39(DQ17) ; port PL_DDR_Data_Byte#2.DDR_DQ1
PL_DDR_DQ18: J6.49(DQ18) ; port PL_DDR_Data_Byte#2.DDR_DQ2
PL_DDR_DQ19: J6.51(DQ19) ; port PL_DDR_Data_Byte#2.DDR_DQ3
PL_DDR_DQ20: J6.40(DQ20) ; port PL_DDR_Data_Byte#2.DDR_DQ4
PL_DDR_DQ21: J6.42(DQ21) ; port PL_DDR_Data_Byte#2.DDR_DQ5
PL_DDR_DQ22: J6.48(DQ22) ; port PL_DDR_Data_Byte#2.DDR_DQ6
PL_DDR_DQ23: J6.50(DQ23) ; port PL_DDR_Data_Byte#2.DDR_DQ7
PL_DDR_DQ24: J6.55(DQ24) ; port PL_DDR_Data_Byte#3.DDR_DQ0
PL_DDR_DQ25: J6.57(DQ25) ; port PL_DDR_Data_Byte#3.DDR_DQ1
PL_DDR_DQ26: J6.63(DQ26) ; port PL_DDR_Data_Byte#3.DDR_DQ2
PL_DDR_DQ27: J6.65(DQ27) ; port PL_DDR_Data_Byte#3.DDR_DQ3
PL_DDR_DQ28: J6.54(DQ28) ; port PL_DDR_Data_Byte#3.DDR_DQ4
PL_DDR_DQ29: J6.56(DQ29) ; port PL_DDR_Data_Byte#3.DDR_DQ5
PL_DDR_DQ30: J6.66(DQ30) ; port PL_DDR_Data_Byte#3.DDR_DQ6
PL_DDR_DQ31: J6.68(DQ31) ; port PL_DDR_Data_Byte#3.DDR_DQ7
PL_DDR_DQ32: J6.133(DQ32) ; port PL_DDR_Data_Byte#4.DDR_DQ0
PL_DDR_DQ33: J6.135(DQ33) ; port PL_DDR_Data_Byte#4.DDR_DQ1
PL_DDR_DQ34: J6.145(DQ34) ; port PL_DDR_Data_Byte#4.DDR_DQ2
PL_DDR_DQ35: J6.147(DQ35) ; port PL_DDR_Data_Byte#4.DDR_DQ3
PL_DDR_DQ36: J6.134(DQ36) ; port PL_DDR_Data_Byte#4.DDR_DQ4
PL_DDR_DQ37: J6.136(DQ37) ; port PL_DDR_Data_Byte#4.DDR_DQ5
PL_DDR_DQ38: J6.142(DQ38) ; port PL_DDR_Data_Byte#4.DDR_DQ6
PL_DDR_DQ39: J6.144(DQ39) ; port PL_DDR_Data_Byte#4.DDR_DQ7
PL_DDR_DQ40: J6.151(DQ40) ; port PL_DDR_Data_Byte#5.DDR_DQ0
PL_DDR_DQ41: J6.153(DQ41) ; port PL_DDR_Data_Byte#5.DDR_DQ1
PL_DDR_DQ42: J6.159(DQ42) ; port PL_DDR_Data_Byte#5.DDR_DQ2
PL_DDR_DQ43: J6.161(DQ43) ; port PL_DDR_Data_Byte#5.DDR_DQ3
PL_DDR_DQ44: J6.148(DQ44) ; port PL_DDR_Data_Byte#5.DDR_DQ4
PL_DDR_DQ45: J6.150(DQ45) ; port PL_DDR_Data_Byte#5.DDR_DQ5
PL_DDR_DQ46: J6.160(DQ46) ; port PL_DDR_Data_Byte#5.DDR_DQ6
PL_DDR_DQ47: J6.162(DQ47) ; port PL_DDR_Data_Byte#5.DDR_DQ7
PL_DDR_DQ48: J6.165(DQ48) ; port PL_DDR_Data_Byte#6.DDR_DQ0
PL_DDR_DQ49: J6.167(DQ49) ; port PL_DDR_Data_Byte#6.DDR_DQ1
PL_DDR_DQ50: J6.177(DQ50) ; port PL_DDR_Data_Byte#6.DDR_DQ2
PL_DDR_DQ51: J6.179(DQ51) ; port PL_DDR_Data_Byte#6.DDR_DQ3
PL_DDR_DQ52: J6.166(DQ52) ; port PL_DDR_Data_Byte#6.DDR_DQ4
PL_DDR_DQ53: J6.168(DQ53) ; port PL_DDR_Data_Byte#6.DDR_DQ5
PL_DDR_DQ54: J6.174(DQ54) ; port PL_DDR_Data_Byte#6.DDR_DQ6
PL_DDR_DQ55: J6.176(DQ55) ; port PL_DDR_Data_Byte#6.DDR_DQ7
PL_DDR_DQ56: J6.183(DQ56) ; port PL_DDR_Data_Byte#7.DDR_DQ0
PL_DDR_DQ57: J6.185(DQ57) ; port PL_DDR_Data_Byte#7.DDR_DQ1
PL_DDR_DQ58: J6.191(DQ58) ; port PL_DDR_Data_Byte#7.DDR_DQ2
PL_DDR_DQ59: J6.193(DQ59) ; port PL_DDR_Data_Byte#7.DDR_DQ3
PL_DDR_DQ60: J6.180(DQ60) ; port PL_DDR_Data_Byte#7.DDR_DQ4
PL_DDR_DQ61: J6.182(DQ61) ; port PL_DDR_Data_Byte#7.DDR_DQ5
PL_DDR_DQ62: J6.192(DQ62) ; port PL_DDR_Data_Byte#7.DDR_DQ6
PL_DDR_DQ63: J6.194(DQ63) ; port PL_DDR_Data_Byte#7.DDR_DQ7
PL_DDR_DQ64: J6.69(CB0) ; port PL_DDR_Data_Byte#8.DDR_DQ0
PL_DDR_DQ65: J6.71(CB1) ; port PL_DDR_Data_Byte#8.DDR_DQ1
PL_DDR_DQ66: J6.81(CB2) ; port PL_DDR_Data_Byte#8.DDR_DQ2
PL_DDR_DQ67: J6.83(CB3) ; port PL_DDR_Data_Byte#8.DDR_DQ3
PL_DDR_DQ68: J6.72(CB4) ; port PL_DDR_Data_Byte#8.DDR_DQ4
PL_DDR_DQ69: J6.74(CB5) ; port PL_DDR_Data_Byte#8.DDR_DQ5
PL_DDR_DQ70: J6.80(CB6) ; port PL_DDR_Data_Byte#8.DDR_DQ6
PL_DDR_DQ71: J6.82(CB7) ; port PL_DDR_Data_Byte#8.DDR_DQ7
PL_DDR_DQS_Byte0_N: J6.10(DQS0) ; port PL_DDR_Data_Byte#0.DDR_DQS_N
PL_DDR_DQS_Byte0_P: J6.12(~{DQS}0) ; port PL_DDR_Data_Byte#0.DDR_DQS_P
PL_DDR_DQS_Byte1_N: J6.25(DQS1) ; port PL_DDR_Data_Byte#1.DDR_DQS_N
PL_DDR_DQS_Byte1_P: J6.27(~{DQS}1) ; port PL_DDR_Data_Byte#1.DDR_DQS_P
PL_DDR_DQS_Byte2_N: J6.43(DQS2) ; port PL_DDR_Data_Byte#2.DDR_DQS_N
PL_DDR_DQS_Byte2_P: J6.45(~{DQS}2) ; port PL_DDR_Data_Byte#2.DDR_DQS_P
PL_DDR_DQS_Byte3_N: J6.60(DQS3) ; port PL_DDR_Data_Byte#3.DDR_DQS_N
PL_DDR_DQS_Byte3_P: J6.62(~{DQS}3) ; port PL_DDR_Data_Byte#3.DDR_DQS_P
PL_DDR_DQS_Byte4_N: J6.139(DQS4) ; port PL_DDR_Data_Byte#4.DDR_DQS_N
PL_DDR_DQS_Byte4_P: J6.141(~{DQS}4) ; port PL_DDR_Data_Byte#4.DDR_DQS_P
PL_DDR_DQS_Byte5_N: J6.154(DQS5) ; port PL_DDR_Data_Byte#5.DDR_DQS_N
PL_DDR_DQS_Byte5_P: J6.156(~{DQS}5) ; port PL_DDR_Data_Byte#5.DDR_DQS_P
PL_DDR_DQS_Byte6_N: J6.171(DQS6) ; port PL_DDR_Data_Byte#6.DDR_DQS_N
PL_DDR_DQS_Byte6_P: J6.173(~{DQS}6) ; port PL_DDR_Data_Byte#6.DDR_DQS_P
PL_DDR_DQS_Byte7_N: J6.186(DQS7) ; port PL_DDR_Data_Byte#7.DDR_DQS_N
PL_DDR_DQS_Byte7_P: J6.188(~{DQS}7) ; port PL_DDR_Data_Byte#7.DDR_DQS_P
PL_DDR_DQS_Byte8_N: J6.75(DQS8) ; port PL_DDR_Data_Byte#8.DDR_DQS_N
PL_DDR_DQS_Byte8_P: J6.77(~{DQS}8) ; port PL_DDR_Data_Byte#8.DDR_DQS_P
PL_DDR_ODT: J6.126(ODT0) ; port PL_DDR_Address_Ctrl.DDR_ODT
PL_DDR_RAS: J6.122(RAS) ; port PL_DDR_Address_Ctrl.DDR_RAS
PL_DDR_RST: J6.30(RESET) ; port PL_DDR_Address_Ctrl.DDR_RST
PL_DDR_WE: J6.121(WE) ; port PL_DDR_Address_Ctrl.DDR_WE

Not connected (* = marked no-connect by the designer): J6 88(A15)* 89(CKE1)* 112(~{CK1}/Par_In/NC)* 114(CK1/Err_Out/NC)* 118(S3)* 120(S2)* 128(ODT1)* 129(S1)* 197(SA0)* 198(EVENT)* 200(SDA)* 201(SA1)* 202(SCL)*

### Notes on the sheet
- Project:
- Title:
- Date:
- Designer:
- Sheet
- Revision:
- of
- Commit:

### Library data of the parts
J6 = 2-2013310-1: Connector SODIMM Socket 204 Positions, Right Angle, DDR3/DDR3L +1.5V +1.35V; Memory Type: DDR3, DDR3L, SDRAM; Number of Positions: 204; JEDEC Standard: 204-Pin EP3-6400/EP3-8500/EP3-10600/EP3-12800 DDR3 SDRAM 72b-S0-DIMM Design Specification; Number of Rows: 2; Orientation: Right Angle; Packaging: Tape & Reel (TR); Termination: Solder; Radiation Hardening: No; Form Factor: SODIMM; ComponentLink1Description: Manufacturer; ComponentLink1URL: https://www.te.com/usa-en/product-2-2013310-1.html?te_bu=Cor&te_type=other&te_campaign=oct_glo_manufacturer&elqCampaignId=26136; ComponentLink2Description: Pinout; ComponentLink2URL: https://media-www.micron.com/-/media/client/global/documents/products/data-sheet/modules/sodimm/jtf16c256_512_1gx64hz.pdf?rev=92a9360308b84bd182ce55b117fec160; Supplier 1: RSComponents; Supplier 2: Mouser; Supplier 3: Digi-Key; Supplier Part Number 1: 9097429; Supplier Part Number 2: 571-2-2013310-1; Supplier Part Number 3: A111121CT-ND

## Sheet PS_DDR.SchDoc: PS_DDR
size A3; Author: Carlos Barreiro; Organization: Escuela Técnica Superior de Ingeniería de Sistemas Informáticos de la Universidad Politécnica de Madrid; Address1: Campus Sur de la Universidad Politécnica de Madrid; Address2: Calle de Alan Turing, s/nº; Address3: Madrid 28031; Address4: España; DocumentNumber: 5; SheetNumber: 5; SheetTotal: 16
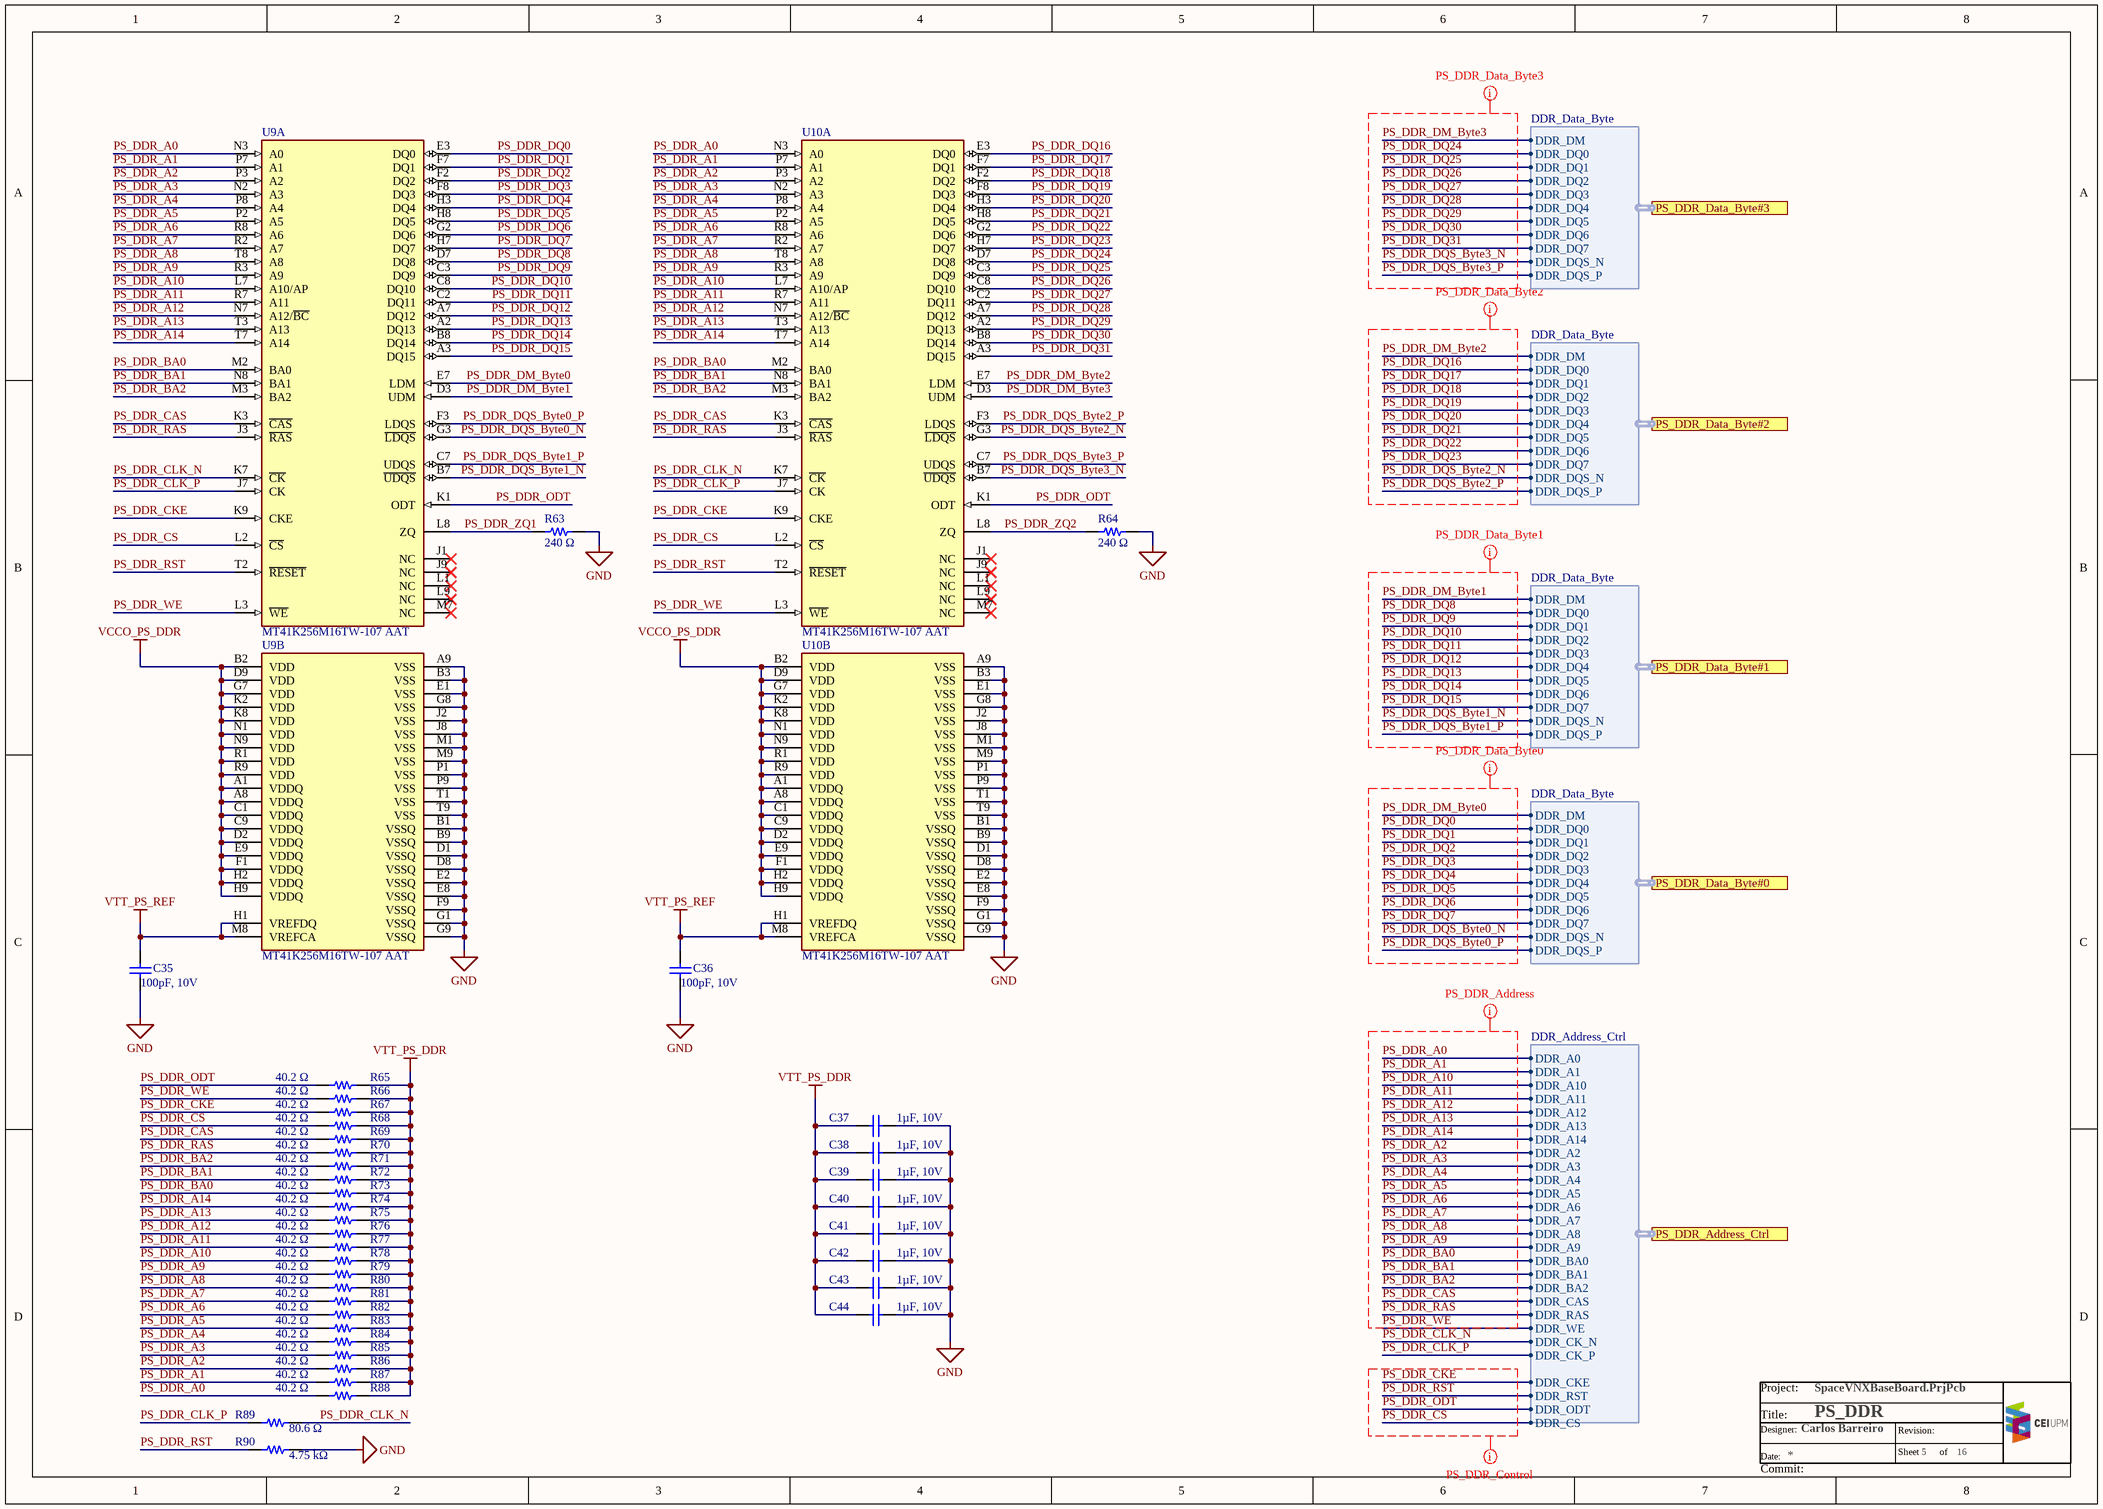
[diagram p6: PS_DDR.SchDoc]

### Parts
C35  100pF, 10V  [WURTH_WCAP-CSGP_0402]
C36  100pF, 10V  [WURTH_WCAP-CSGP_0402]
C37  1µF, 10V  [WURTH_WCAP-CSGP_0402]
C38  1µF, 10V  [WURTH_WCAP-CSGP_0402]
C39  1µF, 10V  [WURTH_WCAP-CSGP_0402]
C40  1µF, 10V  [WURTH_WCAP-CSGP_0402]
C41  1µF, 10V  [WURTH_WCAP-CSGP_0402]
C42  1µF, 10V  [WURTH_WCAP-CSGP_0402]
C43  1µF, 10V  [WURTH_WCAP-CSGP_0402]
C44  1µF, 10V  [WURTH_WCAP-CSGP_0402]
R63  240 Ω  [PANASONIC_ERJ2G_0402]
R64  240 Ω  [PANASONIC_ERJ2G_0402]
R65  40.2 Ω  [PANASONIC_ERJ2G_0402]
R66  40.2 Ω  [PANASONIC_ERJ2G_0402]
R67  40.2 Ω  [PANASONIC_ERJ2G_0402]
R68  40.2 Ω  [PANASONIC_ERJ2G_0402]
R69  40.2 Ω  [PANASONIC_ERJ2G_0402]
R70  40.2 Ω  [PANASONIC_ERJ2G_0402]
R71  40.2 Ω  [PANASONIC_ERJ2G_0402]
R72  40.2 Ω  [PANASONIC_ERJ2G_0402]
R73  40.2 Ω  [PANASONIC_ERJ2G_0402]
R74  40.2 Ω  [PANASONIC_ERJ2G_0402]
R75  40.2 Ω  [PANASONIC_ERJ2G_0402]
R76  40.2 Ω  [PANASONIC_ERJ2G_0402]
R77  40.2 Ω  [PANASONIC_ERJ2G_0402]
R78  40.2 Ω  [PANASONIC_ERJ2G_0402]
R79  40.2 Ω  [PANASONIC_ERJ2G_0402]
R80  40.2 Ω  [PANASONIC_ERJ2G_0402]
R81  40.2 Ω  [PANASONIC_ERJ2G_0402]
R82  40.2 Ω  [PANASONIC_ERJ2G_0402]
R83  40.2 Ω  [PANASONIC_ERJ2G_0402]
R84  40.2 Ω  [PANASONIC_ERJ2G_0402]
R85  40.2 Ω  [PANASONIC_ERJ2G_0402]
R86  40.2 Ω  [PANASONIC_ERJ2G_0402]
R87  40.2 Ω  [PANASONIC_ERJ2G_0402]
R88  40.2 Ω  [PANASONIC_ERJ2G_0402]
R89  80.6 Ω  [PANASONIC_ERJ2G_0402]
R90  4.75 kΩ  [PANASONIC_ERJ2G_0402]
U9  MT41K256M16TW-107 AAT  [Micron_TW]  (parts A,B of 2)
U10  MT41K256M16TW-107 AAT  [Micron_TW]  (parts A,B of 2)

### Ports
PS_DDR_Address_Ctrl (harness DDR_Address_Ctrl), PS_DDR_Data_Byte#0 (harness DDR_Data_Byte), PS_DDR_Data_Byte#1 (harness DDR_Data_Byte), PS_DDR_Data_Byte#2 (harness DDR_Data_Byte), PS_DDR_Data_Byte#3 (harness DDR_Data_Byte)

### Harnesses
DDR_Address_Ctrl: DDR_A0, DDR_A1, DDR_A10, DDR_A11, DDR_A12, DDR_A13, DDR_A14, DDR_A2, DDR_A3, DDR_A4, DDR_A5, DDR_A6, DDR_A7, DDR_A8, DDR_A9, DDR_BA0, DDR_BA1, DDR_BA2, DDR_CAS, DDR_CK_N, DDR_CK_P, DDR_CKE, DDR_CS, DDR_ODT, DDR_RAS, DDR_RST, DDR_WE
DDR_Data_Byte: DDR_DM, DDR_DQ0, DDR_DQ1, DDR_DQ2, DDR_DQ3, DDR_DQ4, DDR_DQ5, DDR_DQ6, DDR_DQ7, DDR_DQS_N, DDR_DQS_P

### Nets
GND: C35.1 C36.1 C37.1 C38.1 C39.1 C40.1 C41.1 C42.1 C43.1 C44.1 R63.2 R64.2 R90.2 U9.A9(VSS) U9.B1(VSSQ) U9.B3(VSS) U9.B9(VSSQ) U9.D1(VSSQ) U9.D8(VSSQ) U9.E1(VSS) U9.E2(VSSQ) U9.E8(VSSQ) U9.F9(VSSQ) U9.G1(VSSQ) U9.G8(VSS) U9.G9(VSSQ) U9.J2(VSS) U9.J8(VSS) U9.M1(VSS) U9.M9(VSS) U9.P1(VSS) U9.P9(VSS) U9.T1(VSS) U9.T9(VSS) U10.A9(VSS) U10.B1(VSSQ) U10.B3(VSS) U10.B9(VSSQ) U10.D1(VSSQ) U10.D8(VSSQ) U10.E1(VSS) U10.E2(VSSQ) U10.E8(VSSQ) U10.F9(VSSQ) U10.G1(VSSQ) U10.G8(VSS) U10.G9(VSSQ) U10.J2(VSS) U10.J8(VSS) U10.M1(VSS) U10.M9(VSS) U10.P1(VSS) U10.P9(VSS) U10.T1(VSS) U10.T9(VSS)
VCCO_PS_DDR: U9.A1(VDDQ) U9.A8(VDDQ) U9.B2(VDD) U9.C1(VDDQ) U9.C9(VDDQ) U9.D2(VDDQ) U9.D9(VDD) U9.E9(VDDQ) U9.F1(VDDQ) U9.G7(VDD) U9.H2(VDDQ) U9.H9(VDDQ) U9.K2(VDD) U9.K8(VDD) U9.N1(VDD) U9.N9(VDD) U9.R1(VDD) U9.R9(VDD) U10.A1(VDDQ) U10.A8(VDDQ) U10.B2(VDD) U10.C1(VDDQ) U10.C9(VDDQ) U10.D2(VDDQ) U10.D9(VDD) U10.E9(VDDQ) U10.F1(VDDQ) U10.G7(VDD) U10.H2(VDDQ) U10.H9(VDDQ) U10.K2(VDD) U10.K8(VDD) U10.N1(VDD) U10.N9(VDD) U10.R1(VDD) U10.R9(VDD)
VTT_PS_DDR: C37.2 C38.2 C39.2 C40.2 C41.2 C42.2 C43.2 C44.2 R65.1 R66.1 R67.1 R68.1 R69.1 R70.1 R71.1 R72.1 R73.1 R74.1 R75.1 R76.1 R77.1 R78.1 R79.1 R80.1 R81.1 R82.1 R83.1 R84.1 R85.1 R86.1 R87.1 R88.1
VTT_PS_REF: C35.2 C36.2 U9.H1(VREFDQ) U9.M8(VREFCA) U10.H1(VREFDQ) U10.M8(VREFCA)
PS_DDR_A0: R88.2 U9.N3(A0) U10.N3(A0) ; port PS_DDR_Address_Ctrl.DDR_A0
PS_DDR_A1: R87.2 U9.P7(A1) U10.P7(A1) ; port PS_DDR_Address_Ctrl.DDR_A1
PS_DDR_A2: R86.2 U9.P3(A2) U10.P3(A2) ; port PS_DDR_Address_Ctrl.DDR_A2
PS_DDR_A3: R85.2 U9.N2(A3) U10.N2(A3) ; port PS_DDR_Address_Ctrl.DDR_A3
PS_DDR_A4: R84.2 U9.P8(A4) U10.P8(A4) ; port PS_DDR_Address_Ctrl.DDR_A4
PS_DDR_A5: R83.2 U9.P2(A5) U10.P2(A5) ; port PS_DDR_Address_Ctrl.DDR_A5
PS_DDR_A6: R82.2 U9.R8(A6) U10.R8(A6) ; port PS_DDR_Address_Ctrl.DDR_A6
PS_DDR_A7: R81.2 U9.R2(A7) U10.R2(A7) ; port PS_DDR_Address_Ctrl.DDR_A7
PS_DDR_A8: R80.2 U9.T8(A8) U10.T8(A8) ; port PS_DDR_Address_Ctrl.DDR_A8
PS_DDR_A9: R79.2 U9.R3(A9) U10.R3(A9) ; port PS_DDR_Address_Ctrl.DDR_A9
PS_DDR_A10: R78.2 U9.L7(A10/AP) U10.L7(A10/AP) ; port PS_DDR_Address_Ctrl.DDR_A10
PS_DDR_A11: R77.2 U9.R7(A11) U10.R7(A11) ; port PS_DDR_Address_Ctrl.DDR_A11
PS_DDR_A12: R76.2 U9.N7(A12/~{BC}) U10.N7(A12/~{BC}) ; port PS_DDR_Address_Ctrl.DDR_A12
PS_DDR_A13: R75.2 U9.T3(A13) U10.T3(A13) ; port PS_DDR_Address_Ctrl.DDR_A13
PS_DDR_A14: R74.2 U9.T7(A14) U10.T7(A14) ; port PS_DDR_Address_Ctrl.DDR_A14
PS_DDR_BA0: R73.2 U9.M2(BA0) U10.M2(BA0) ; port PS_DDR_Address_Ctrl.DDR_BA0
PS_DDR_BA1: R72.2 U9.N8(BA1) U10.N8(BA1) ; port PS_DDR_Address_Ctrl.DDR_BA1
PS_DDR_BA2: R71.2 U9.M3(BA2) U10.M3(BA2) ; port PS_DDR_Address_Ctrl.DDR_BA2
PS_DDR_CAS: R69.2 U9.K3(~{CAS}) U10.K3(~{CAS}) ; port PS_DDR_Address_Ctrl.DDR_CAS
PS_DDR_CKE: R67.2 U9.K9(CKE) U10.K9(CKE) ; port PS_DDR_Address_Ctrl.DDR_CKE
PS_DDR_CLK_N: R89.2 U9.K7(~{CK}) U10.K7(~{CK}) ; port PS_DDR_Address_Ctrl.DDR_CK_N
PS_DDR_CLK_P: R89.1 U9.J7(CK) U10.J7(CK) ; port PS_DDR_Address_Ctrl.DDR_CK_P
PS_DDR_CS: R68.2 U9.L2(~{CS}) U10.L2(~{CS}) ; port PS_DDR_Address_Ctrl.DDR_CS
PS_DDR_DM_Byte0: U9.E7(LDM) ; port PS_DDR_Data_Byte#0.DDR_DM
PS_DDR_DM_Byte1: U9.D3(UDM) ; port PS_DDR_Data_Byte#1.DDR_DM
PS_DDR_DM_Byte2: U10.E7(LDM) ; port PS_DDR_Data_Byte#2.DDR_DM
PS_DDR_DM_Byte3: U10.D3(UDM) ; port PS_DDR_Data_Byte#3.DDR_DM
PS_DDR_DQ0: U9.E3(DQ0) ; port PS_DDR_Data_Byte#0.DDR_DQ0
PS_DDR_DQ1: U9.F7(DQ1) ; port PS_DDR_Data_Byte#0.DDR_DQ1
PS_DDR_DQ2: U9.F2(DQ2) ; port PS_DDR_Data_Byte#0.DDR_DQ2
PS_DDR_DQ3: U9.F8(DQ3) ; port PS_DDR_Data_Byte#0.DDR_DQ3
PS_DDR_DQ4: U9.H3(DQ4) ; port PS_DDR_Data_Byte#0.DDR_DQ4
PS_DDR_DQ5: U9.H8(DQ5) ; port PS_DDR_Data_Byte#0.DDR_DQ5
PS_DDR_DQ6: U9.G2(DQ6) ; port PS_DDR_Data_Byte#0.DDR_DQ6
PS_DDR_DQ7: U9.H7(DQ7) ; port PS_DDR_Data_Byte#0.DDR_DQ7
PS_DDR_DQ8: U9.D7(DQ8) ; port PS_DDR_Data_Byte#1.DDR_DQ0
PS_DDR_DQ9: U9.C3(DQ9) ; port PS_DDR_Data_Byte#1.DDR_DQ1
PS_DDR_DQ10: U9.C8(DQ10) ; port PS_DDR_Data_Byte#1.DDR_DQ2
PS_DDR_DQ11: U9.C2(DQ11) ; port PS_DDR_Data_Byte#1.DDR_DQ3
PS_DDR_DQ12: U9.A7(DQ12) ; port PS_DDR_Data_Byte#1.DDR_DQ4
PS_DDR_DQ13: U9.A2(DQ13) ; port PS_DDR_Data_Byte#1.DDR_DQ5
PS_DDR_DQ14: U9.B8(DQ14) ; port PS_DDR_Data_Byte#1.DDR_DQ6
PS_DDR_DQ15: U9.A3(DQ15) ; port PS_DDR_Data_Byte#1.DDR_DQ7
PS_DDR_DQ16: U10.E3(DQ0) ; port PS_DDR_Data_Byte#2.DDR_DQ0
PS_DDR_DQ17: U10.F7(DQ1) ; port PS_DDR_Data_Byte#2.DDR_DQ1
PS_DDR_DQ18: U10.F2(DQ2) ; port PS_DDR_Data_Byte#2.DDR_DQ2
PS_DDR_DQ19: U10.F8(DQ3) ; port PS_DDR_Data_Byte#2.DDR_DQ3
PS_DDR_DQ20: U10.H3(DQ4) ; port PS_DDR_Data_Byte#2.DDR_DQ4
PS_DDR_DQ21: U10.H8(DQ5) ; port PS_DDR_Data_Byte#2.DDR_DQ5
PS_DDR_DQ22: U10.G2(DQ6) ; port PS_DDR_Data_Byte#2.DDR_DQ6
PS_DDR_DQ23: U10.H7(DQ7) ; port PS_DDR_Data_Byte#2.DDR_DQ7
PS_DDR_DQ24: U10.D7(DQ8) ; port PS_DDR_Data_Byte#3.DDR_DQ0
PS_DDR_DQ25: U10.C3(DQ9) ; port PS_DDR_Data_Byte#3.DDR_DQ1
PS_DDR_DQ26: U10.C8(DQ10) ; port PS_DDR_Data_Byte#3.DDR_DQ2
PS_DDR_DQ27: U10.C2(DQ11) ; port PS_DDR_Data_Byte#3.DDR_DQ3
PS_DDR_DQ28: U10.A7(DQ12) ; port PS_DDR_Data_Byte#3.DDR_DQ4
PS_DDR_DQ29: U10.A2(DQ13) ; port PS_DDR_Data_Byte#3.DDR_DQ5
PS_DDR_DQ30: U10.B8(DQ14) ; port PS_DDR_Data_Byte#3.DDR_DQ6
PS_DDR_DQ31: U10.A3(DQ15) ; port PS_DDR_Data_Byte#3.DDR_DQ7
PS_DDR_DQS_Byte0_N: U9.G3(~{LDQS}) ; port PS_DDR_Data_Byte#0.DDR_DQS_N
PS_DDR_DQS_Byte0_P: U9.F3(LDQS) ; port PS_DDR_Data_Byte#0.DDR_DQS_P
PS_DDR_DQS_Byte1_N: U9.B7(~{UDQS}) ; port PS_DDR_Data_Byte#1.DDR_DQS_N
PS_DDR_DQS_Byte1_P: U9.C7(UDQS) ; port PS_DDR_Data_Byte#1.DDR_DQS_P
PS_DDR_DQS_Byte2_N: U10.G3(~{LDQS}) ; port PS_DDR_Data_Byte#2.DDR_DQS_N
PS_DDR_DQS_Byte2_P: U10.F3(LDQS) ; port PS_DDR_Data_Byte#2.DDR_DQS_P
PS_DDR_DQS_Byte3_N: U10.B7(~{UDQS}) ; port PS_DDR_Data_Byte#3.DDR_DQS_N
PS_DDR_DQS_Byte3_P: U10.C7(UDQS) ; port PS_DDR_Data_Byte#3.DDR_DQS_P
PS_DDR_ODT: R65.2 U9.K1(ODT) U10.K1(ODT) ; port PS_DDR_Address_Ctrl.DDR_ODT
PS_DDR_RAS: R70.2 U9.J3(~{RAS}) U10.J3(~{RAS}) ; port PS_DDR_Address_Ctrl.DDR_RAS
PS_DDR_RST: R90.1 U9.T2(~{RESET}) U10.T2(~{RESET}) ; port PS_DDR_Address_Ctrl.DDR_RST
PS_DDR_WE: R66.2 U9.L3(~{WE}) U10.L3(~{WE}) ; port PS_DDR_Address_Ctrl.DDR_WE
PS_DDR_ZQ1: R63.1 U9.L8(ZQ)
PS_DDR_ZQ2: R64.1 U10.L8(ZQ)

Not connected (* = marked no-connect by the designer): U9 J1(NC)* J9(NC)* L1(NC)* L9(NC)* M7(NC)*; U10 J1(NC)* J9(NC)* L1(NC)* L9(NC)* M7(NC)*

### Layout directives
net class PS_DDR_Data_Byte3: PS_DDR_DM_Byte3, PS_DDR_DQ24, PS_DDR_DQ25, PS_DDR_DQ26, PS_DDR_DQ27, PS_DDR_DQ28, PS_DDR_DQ29, PS_DDR_DQ30, PS_DDR_DQ31, PS_DDR_DQS_Byte3_N, PS_DDR_DQS_Byte3_P
net class PS_DDR_Data_Byte2: PS_DDR_DM_Byte2, PS_DDR_DQ16, PS_DDR_DQ17, PS_DDR_DQ18, PS_DDR_DQ19, PS_DDR_DQ20, PS_DDR_DQ21, PS_DDR_DQ22, PS_DDR_DQ23, PS_DDR_DQS_Byte2_N, PS_DDR_DQS_Byte2_P
net class PS_DDR_Data_Byte1: PS_DDR_DM_Byte1, PS_DDR_DQ8, PS_DDR_DQ9, PS_DDR_DQ10, PS_DDR_DQ11, PS_DDR_DQ12, PS_DDR_DQ13, PS_DDR_DQ14, PS_DDR_DQ15, PS_DDR_DQS_Byte1_N, PS_DDR_DQS_Byte1_P
net class PS_DDR_Data_Byte0: PS_DDR_DM_Byte0, PS_DDR_DQ0, PS_DDR_DQ1, PS_DDR_DQ2, PS_DDR_DQ3, PS_DDR_DQ4, PS_DDR_DQ5, PS_DDR_DQ6, PS_DDR_DQ7, PS_DDR_DQS_Byte0_N, PS_DDR_DQS_Byte0_P
net class PS_DDR_Address: PS_DDR_A0, PS_DDR_A1, PS_DDR_A2, PS_DDR_A3, PS_DDR_A4, PS_DDR_A5, PS_DDR_A6, PS_DDR_A7, PS_DDR_A8, PS_DDR_A9, PS_DDR_A10, PS_DDR_A11, PS_DDR_A12, PS_DDR_A13, PS_DDR_A14, PS_DDR_BA0, PS_DDR_BA1, PS_DDR_BA2, PS_DDR_CAS, PS_DDR_RAS, PS_DDR_WE
net class PS_DDR_Control: PS_DDR_CKE, PS_DDR_CS, PS_DDR_ODT, PS_DDR_RST

### Notes on the sheet
- Project:
- Title:
- Date:
- Designer:
- Sheet
- Revision:
- of
- Commit:

### Library data of the parts
C35 C36 = 885012005013: WCAP-CSGP Multilayer Ceramic Chip Capacitor, General Purpose, size 0402, NP0, 100pF, 10V; Manufacturer: Wurth Elektronik; Rated Voltage: 10VDC; Isolation Resistance  min.: 10GOhm; Capacitance Tolerance: +/-5%; Technical Reference: NP00402101J010DFCT10000; Q-Factor min.: 1000; ComponentLink1Description: Manufacturer; ComponentLink1URL: http://www.we-online.de; ComponentLink2Description: Datasheet; ComponentLink2URL: https://www.we-online.com/catalog/datasheet/885012005013.pdf; Operating Temperature: -55 to +125degC; Packaging: Tape and Reel; Manufacturer Part Number: 885012005013; Published Date: April 2021; Ceramic Type: NP0; Dissipation Factor max.: -; Height: 0.5mm; Mounting Technology: SMT; Size: 0402; Capacitance: 100pF
C37-C44 = 885012105012: WCAP-CSGP Multilayer Ceramic Chip Capacitor, General Purpose, size 0402, X5R, 1uF, 10V; Manufacturer: Wurth Elektronik; Rated Voltage: 10VDC; Isolation Resistance  min.: 0.05GOhm; Capacitance Tolerance: +/-20%; Dissipation Factor max.: 15%; Technical Reference: X5R0402105M010DFCT10000; ComponentLink1Description: Manufacturer; ComponentLink1URL: http://www.we-online.de; ComponentLink2Description: Datasheet; ComponentLink2URL: https://www.we-online.com/catalog/datasheet/885012105012.pdf; Operating Temperature: -55 to +85degC; Packaging: Tape and Reel; Manufacturer Part Number: 885012105012; Published Date: April 2021; Ceramic Type: X5R; Height: 0.5mm; Mounting Technology: SMT; Size: 0402; Capacitance: 1uF; Q-Factor min.: -; Supplier 1: Digi-Key; Supplier 2: Mouser; Supplier Part Number 2: 710-885012105012; Supplier Part Number 1: 732-7489-1-ND
R63 R64 = ERJ2GEJ241X: General Purpose Thick Film Chip Resistors; Manufacturer: Panasonic; Power (0402): 0.1 W; Limiting Voltage (0402): 50; Maximum Voltage (0402): 100; Resistance Range (Ω): 1Ω to 100MΩ; AEC 200: Grade 0; Size (0402): 2GE; ComponentLink1Description: Catalog; ComponentLink1URL: https://industrial.panasonic.com/ww/products/pt/general-purpose-chip-resistors/models?op=search&model_status_current=1&page=0#model-list-search-results; Series: ERJ; Temperature Range (ºC): -55 to +155; Supplier 1: Newark; Supplier 2: Mouser; Supplier Part Number 1: 85Y7936; Supplier Part Number 2: 667-ERJ-2GEJ241X
R65-R88 = ERJ2RKF40R2X: General Purpose Thick Film Chip Resistors; Manufacturer: Panasonic; Power (0402): 0.1 W; Limiting Voltage (0402): 50; Maximum Voltage (0402): 100; Resistance Range (Ω): 1Ω to 100MΩ; AEC 200: Grade 0; Size (0402): 2GE; ComponentLink1Description: Catalog; ComponentLink1URL: https://industrial.panasonic.com/ww/products/pt/general-purpose-chip-resistors/models?op=search&model_status_current=1&page=0#model-list-search-results; Series: ERJ; Temperature Range (ºC): -55 to +155; Supplier 1: Newark; Supplier 2: Digi-Key; Supplier Part Number 1: 27AC5044; Supplier Part Number 2: P40.2LCT-ND
R89 = ERJ2RKF80R6X: General Purpose Thick Film Chip Resistors; Manufacturer: Panasonic; Power (0402): 0.1 W; Limiting Voltage (0402): 50; Maximum Voltage (0402): 100; Resistance Range (Ω): 1Ω to 100MΩ; AEC 200: Grade 0; Size (0402): 2GE; ComponentLink1Description: Catalog; ComponentLink1URL: https://industrial.panasonic.com/ww/products/pt/general-purpose-chip-resistors/models?op=search&model_status_current=1&page=0#model-list-search-results; Series: ERJ; Temperature Range (ºC): -55 to +155; Supplier 1: Digi-Key; Supplier 2: Mouser; Supplier Part Number 1: P80.6LCT-ND; Supplier Part Number 2: 667-ERJ-2RKF80R6X
R90 = ERJ2RKF4751X: General Purpose Thick Film Chip Resistors; Manufacturer: Panasonic; Power (0402): 0.1 W; Limiting Voltage (0402): 50; Maximum Voltage (0402): 100; Resistance Range (Ω): 1Ω to 100MΩ; AEC 200: Grade 0; Size (0402): 2GE; ComponentLink1Description: Catalog; ComponentLink1URL: https://industrial.panasonic.com/ww/products/pt/general-purpose-chip-resistors/models?op=search&model_status_current=1&page=0#model-list-search-results; Series: ERJ; Temperature Range (ºC): -55 to +155; Supplier 1: RSComponents; Supplier 2: Digi-Key; Supplier Part Number 1: 1065277; Supplier Part Number 2: P4.75KLCT-ND
U9 U10 = MT41K256M16TW-107 AAT: DDR3L SDRAM; Data Rate: DDR3-1866; Density: 4Gb; FBGA Code: D9SHM; Nominal Supply Voltage (DC): 1.35 V; Supplier 1: Digi-Key; Supplier 2: Mouser; Supplier Part Number 1: MT41K256M16TW-107IT:P-ND; Supplier Part Number 2: 340-265862-TRAY; Operating Temperature: -40ºC to +105ºC; Width: x16; Part Status: Production; Depth: 256 Meg; ComponentLink1Description: Manufacturer URL; ComponentLink1URL: http://www.micron.com/